# EAGLE design MTB-v1.2.0 (EAGLE 7.7.0)

## Sheet 1 of 4
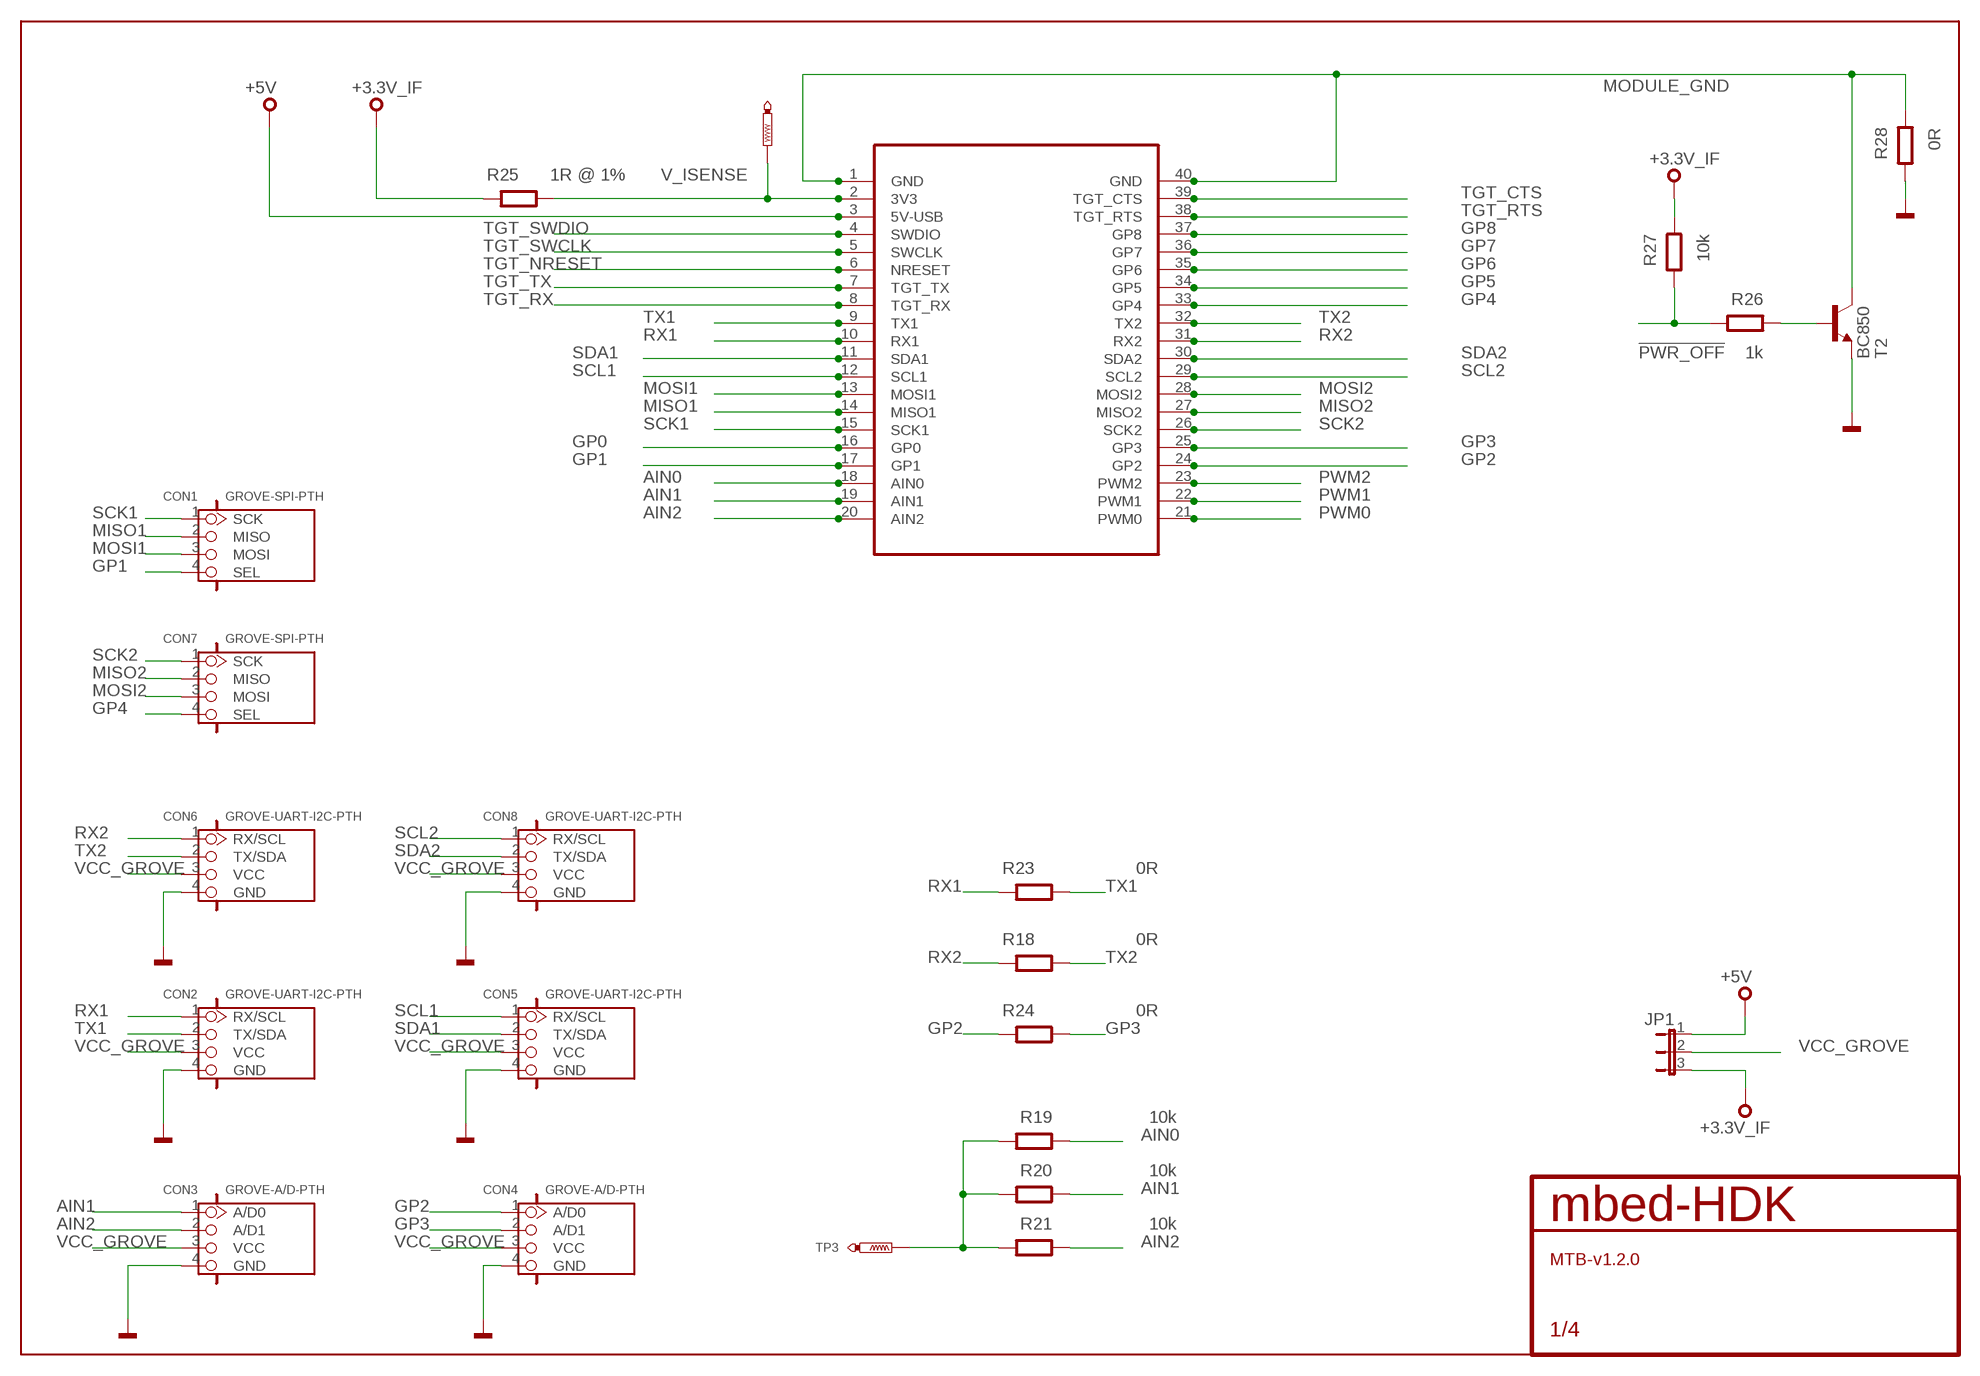
[diagram p0: schematic, sheet 1]

### Parts
CON1  GROVE-SPI-PTH  [HW4-2.0]
CON2  GROVE-UART-I2C-PTH  [HW4-2.0]
CON3  GROVE-A/D-PTH  [HW4-2.0]
CON4  GROVE-A/D-PTH  [HW4-2.0]
CON5  GROVE-UART-I2C-PTH  [HW4-2.0]
CON6  GROVE-UART-I2C-PTH  [HW4-2.0]
CON7  GROVE-SPI-PTH  [HW4-2.0]
CON8  GROVE-UART-I2C-PTH  [HW4-2.0]
JP1  JP2E  [JP2]
R18  0R  R0603  [0603@1]
R19  10k  R0603  [0603@1]
R20  10k  R0603  [0603@1]
R21  10k  R0603  [0603@1]
R23  0R  R0603  [0603@1]
R24  0R  R0603  [0603@1]
R25  1R @ 1%  R0603  [0603@1]
R26  1k  R0603  [0603@1]
R27  10k  R0603  [0603@1]
R28  0R  R0603  [0603@1]
SKT1  MODULE_SOCKET  [MODULE_SOCKET]
T2  BC850  [SOT23]
TP3  TEST-POINT-50R-PTH  [TP50-PTH]
TP8  PTR1TP07R  [TP07R]

### Nets
!PWR_OFF: R26.2 R27.2 ; also sheet 3
+3.3V_IF: JP1.3 R25.2 R27.1 ; also sheet 2,3,4
+5V: JP1.1 SKT1.3(5V-USB) SKT1.P$43 ; also sheet 2
AIN0: R19.1 SKT1.18(AIN0) SKT1.P$58 ; also sheet 4
AIN1: CON3.1(A/D0) R20.1 SKT1.19(AIN1) SKT1.P$59
AIN2: CON3.2(A/D1) R21.1 SKT1.20(AIN2) SKT1.P$60
GND: CON2.4(GND) CON3.4(GND) CON4.4(GND) CON5.4(GND) CON6.4(GND) CON8.4(GND) R28.2 T2.2(E) ; also sheet 2,3,4
GP0: SKT1.16(GP0) SKT1.P$56 ; also sheet 4
GP1: CON1.4(SEL) SKT1.17(GP1) SKT1.P$57
GP2: CON4.1(A/D0) R24.2 SKT1.24(GP2) SKT1.P$64 ; also sheet 4
GP3: CON4.2(A/D1) R24.1 SKT1.25(GP3) SKT1.P$65
GP4: CON7.4(SEL) SKT1.33(GP4) SKT1.P$73
GP5: SKT1.34(GP5) SKT1.P$74 ; also sheet 4
GP6: SKT1.35(GP6) SKT1.P$75 ; also sheet 4
GP7: SKT1.36(GP7) SKT1.P$76 ; also sheet 4
GP8: SKT1.37(GP8) SKT1.P$77
MISO1: CON1.2(MISO) SKT1.14(MISO1) SKT1.P$54 ; also sheet 4
MISO2: CON7.2(MISO) SKT1.27(MISO2) SKT1.P$67
MODULE_GND: R28.1 SKT1.1(GND) SKT1.40(GND) SKT1.P$41 SKT1.P$80 T2.3(C)
MOSI1: CON1.3(MOSI) SKT1.13(MOSI1) SKT1.P$53 ; also sheet 4
MOSI2: CON7.3(MOSI) SKT1.28(MOSI2) SKT1.P$68
N$24: R19.2 R20.2 R21.2 TP3.TP
N$28: R26.1 T2.1(B)
PWM0: SKT1.21(PWM0) SKT1.P$61 ; also sheet 4
PWM1: SKT1.22(PWM1) SKT1.P$62 ; also sheet 4
PWM2: SKT1.23(PWM2) SKT1.P$63 ; also sheet 4
RX1: CON2.1(RX/SCL) R23.2 SKT1.10(RX1) SKT1.P$50
RX2: CON6.1(RX/SCL) R18.2 SKT1.31(RX2) SKT1.P$71
SCK1: CON1.1(SCK) SKT1.15(SCK1) SKT1.P$55 ; also sheet 4
SCK2: CON7.1(SCK) SKT1.26(SCK2) SKT1.P$66
SCL1: CON5.1(RX/SCL) SKT1.12(SCL1) SKT1.P$52 ; also sheet 4
SCL2: CON8.1(RX/SCL) SKT1.29(SCL2) SKT1.P$69 ; also sheet 4
SDA1: CON5.2(TX/SDA) SKT1.11(SDA1) SKT1.P$51 ; also sheet 4
SDA2: CON8.2(TX/SDA) SKT1.30(SDA2) SKT1.P$70 ; also sheet 4
TGT_CTS: SKT1.39(TGT_CTS) SKT1.P$79 ; also sheet 3
TGT_NRESET: SKT1.6(NRESET) SKT1.P$46 ; also sheet 3
TGT_RTS: SKT1.38(TGT_RTS) SKT1.P$78 ; also sheet 3
TGT_RX: SKT1.8(TGT_RX) SKT1.P$48 ; also sheet 3
TGT_SWCLK: SKT1.5(SWCLK) SKT1.P$45 ; also sheet 3
TGT_SWDIO: SKT1.4(SWDIO) SKT1.P$44 ; also sheet 3
TGT_TX: SKT1.7(TGT_TX) SKT1.P$47 ; also sheet 3
TX1: CON2.2(TX/SDA) R23.1 SKT1.9(TX1) SKT1.P$49
TX2: CON6.2(TX/SDA) R18.1 SKT1.32(TX2) SKT1.P$72
V_ISENSE: R25.1 SKT1.2(3V3) SKT1.P$42 TP8.TP ; also sheet 3
VCC_GROVE: CON2.3(VCC) CON3.3(VCC) CON4.3(VCC) CON5.3(VCC) CON6.3(VCC) CON8.3(VCC) JP1.2

## Sheet 2 of 4
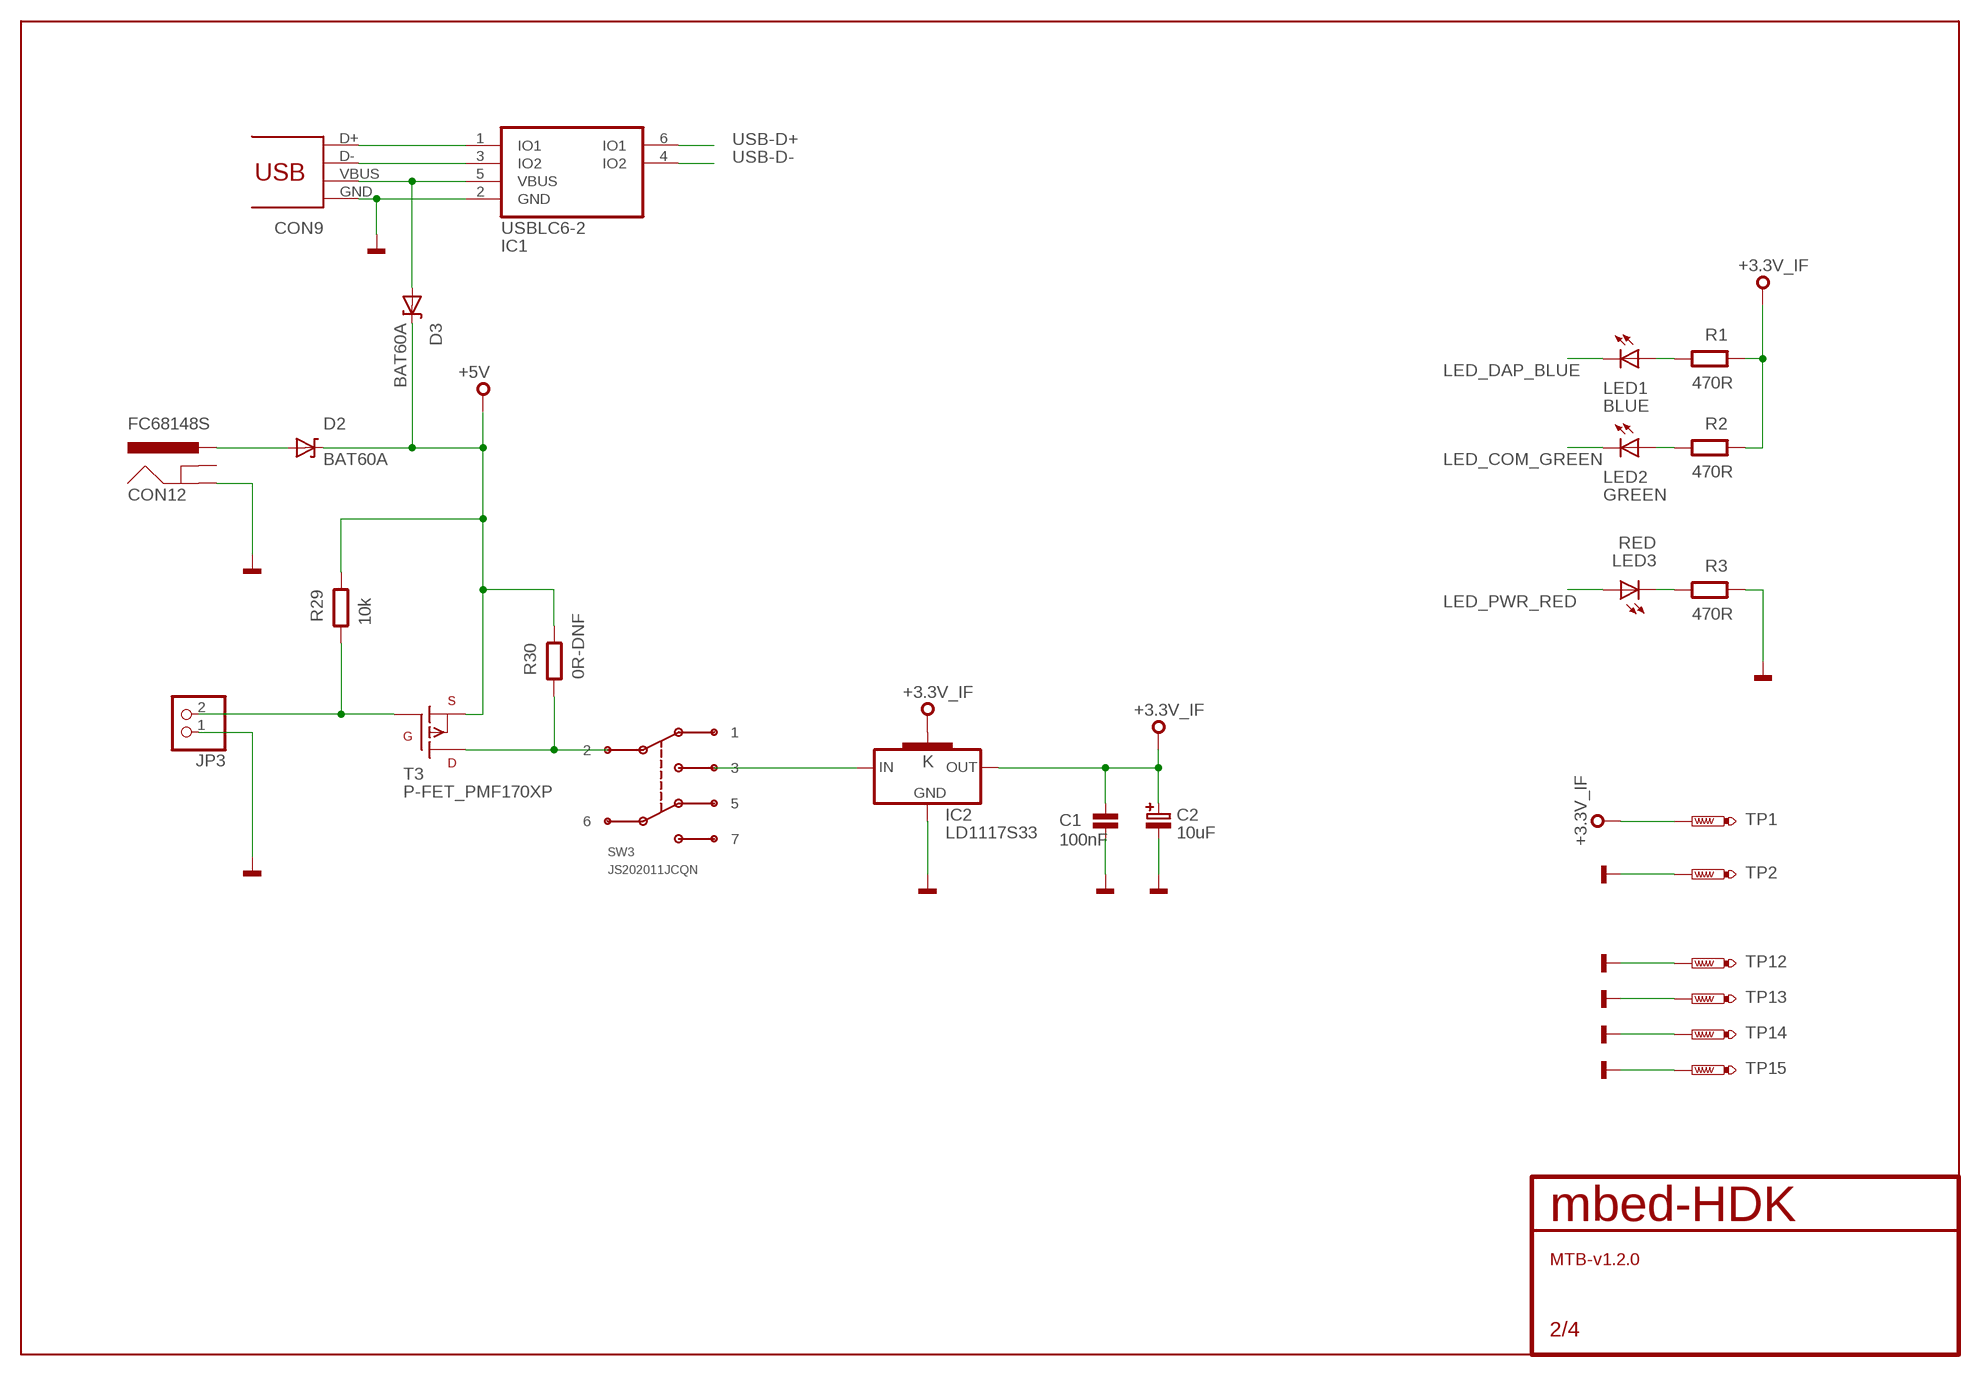
[diagram p1: schematic, sheet 2]

### Parts
C1  100nF  C0603  [0603]
C2  10uF  C-POLB  [SMC_B]
CON9  USB_MICROB  [MOLEX-47364-0001]
CON12  FC68148S  [FC68148S]
D2  BAT60A  [SOD323]
D3  BAT60A  [SOD323]
IC1  USBLC6-2SC6  [SOT23-6L]
IC2  LD1117S33  [SOT223]
JP3  PINHD-1X2  [1X02]
LED1  BLUE  LED0603  [CHIPLED_0603]
LED2  GREEN  LED0603  [CHIPLED_0603]
LED3  RED  LED0603  [CHIPLED_0603]
R1  470R  R0603  [0603@1]
R2  470R  R0603  [0603@1]
R3  470R  R0603  [0603@1]
R29  10k  R0603  [0603@1]
R30  0R-DNF  R0603  [0603@1]
SW3  JS202011JCQN  [JS202011JCQN]
T3  P-FET_PMF170XP  [SOT23-BEC]
TP1  TEST-POINT-50R-PTH  [TP50-PTH]
TP2  TEST-POINT-50R-PTH  [TP50-PTH]
TP12  TEST-POINT-50R-PTH  [TP50-PTH]
TP13  TEST-POINT-50R-PTH  [TP50-PTH]
TP14  TEST-POINT-50R-PTH  [TP50-PTH]
TP15  TEST-POINT-50R-PTH  [TP50-PTH]

### Nets
+3.3V_IF: C1.1 C2.+ IC2.2(OUT) IC2.4(K) R1.1 R2.1 TP1.TP ; also sheet 1,3,4
+5V: D2.K D3.K R29.1 R30.1 T3.E(S) ; also sheet 1
GND: C1.2 C2.- CON9.GND CON12.3(GND) IC1.2(GND) IC2.1(GND) JP3.1 R3.1 TP2.TP TP12.TP TP13.TP TP14.TP TP15.TP ; also sheet 1,3,4
LED_COM_GREEN: LED2.C ; also sheet 3
LED_DAP_BLUE: LED1.C ; also sheet 3
LED_PWR_RED: LED3.A ; also sheet 3
N$1: CON9.D+ IC1.1(IO1)
N$2: CON9.D- IC1.3(IO2)
N$6: LED2.A R2.2
N$9: LED3.C R3.2
N$13: LED1.A R1.2
N$27: CON9.VBUS D3.A IC1.5(VBUS)
N$29: R30.2 SW3.2 T3.C(D)
N$30: CON12.1-1(PWR) CON12.1-2(PWR) D2.A
N$31: IC2.3(IN) SW3.3
N$32: JP3.2 R29.2 T3.B(G)
USB-D+: IC1.6(IO1) ; also sheet 3
USB-D-: IC1.4(IO2) ; also sheet 3
Unconnected: CON12.2(GNDBREAK) SW3.1 SW3.5 SW3.6 SW3.7

## Sheet 3 of 4
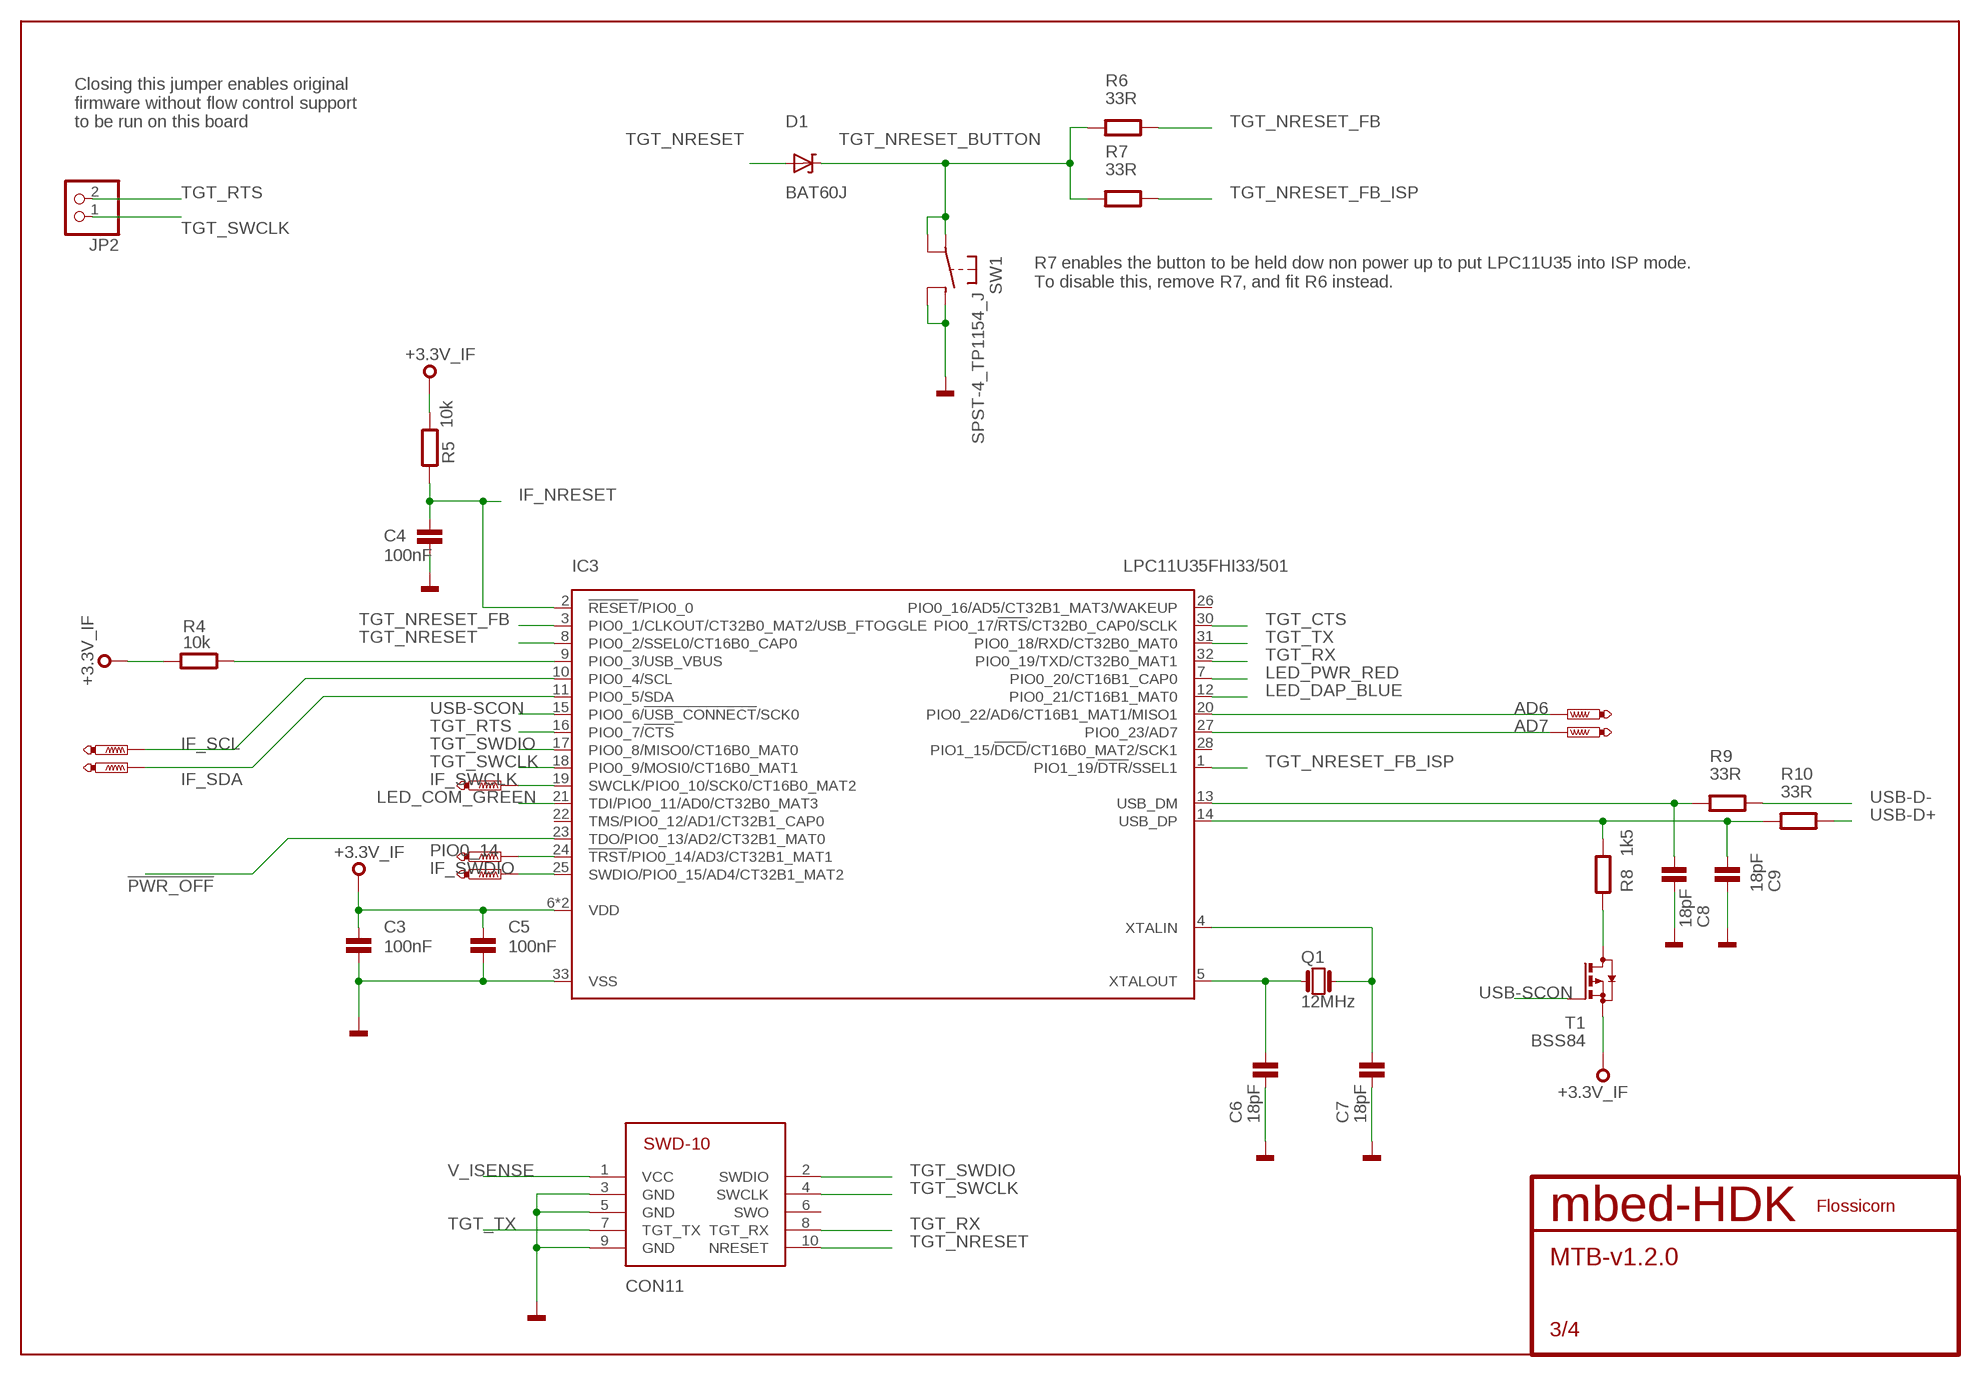
[diagram p2: schematic, sheet 3]

### Parts
C3  100nF  C0603  [0603]
C4  100nF  C0603  [0603]
C5  100nF  C0603  [0603]
C6  18pF  C0603  [0603]
C7  18pF  C0603  [0603]
C8  18pF  C0603  [0603]
C9  18pF  C0603  [0603]
CON11  SWD-10/TC2050_SMD  [FTSH-105-02]
D1  BAT60J  BAT60A  [BAT60A]
IC3  LPC11U35FHI33/501  [SOT617-3]
JP2  PINHD-1X2  [1X02]
Q1  12MHz  Q_3.2X2.5  [3.2X.2.5]
R4  10k  R0603  [0603@1]
R5  10k  R0603  [0603@1]
R6  33R  R0603  [0603@1]
R7  33R  R0603  [0603@1]
R8  1k5  R0603  [0603@1]
R9  33R  R0603  [0603@1]
R10  33R  R0603  [0603@1]
SS1  FLOSSICORN0.5  [FLOSSICORN-0.5]
SW1  SPST-4_TP1154_J  [TP-1154X]
T1  BSS84  [SOT23]
TP4  PTR1TP07R  [TP07R]
TP5  PTR1TP07R  [TP07R]
TP6  PTR1TP07R  [TP07R]
TP7  PTR1TP07R  [TP07R]
TP9  PTR1TP07R  [TP07R]
TP10  PTR1TP07R  [TP07R]
TP11  PTR1TP07R  [TP07R]

### Nets
!PWR_OFF: IC3.23(TDO/PIO0_13/AD2/CT32B1_MAT0) ; also sheet 1
+3.3V_IF: C3.1 C5.1 IC3.6(VDD) IC3.29(VDD) R4.2 R5.2 T1.2(S) ; also sheet 1,2,4
AD6: IC3.20(PIO0_22/AD6/CT16B1_MAT1/MISO1) TP7.TP
AD7: IC3.27(PIO0_23/AD7) TP6.TP
GND: C3.2 C4.2 C5.2 C6.2 C7.2 C8.2 C9.2 CON11.3(GND) CON11.5(GND) CON11.9(GND) IC3.33(VSS) SW1.B1 SW1.B2 ; also sheet 1,2,4
IF_NRESET: C4.1 IC3.2(!RESET!/PIO0_0) R5.1
IF_SCL: IC3.10(PIO0_4/SCL) TP4.TP
IF_SDA: IC3.11(PIO0_5/SDA) TP5.TP
IF_SWCLK: IC3.19(SWCLK/PIO0_10/SCK0/CT16B0_MAT2) TP10.TP
IF_SWDIO: IC3.25(SWDIO/PIO0_15/AD4/CT32B1_MAT2) TP9.TP
LED_COM_GREEN: IC3.21(TDI/PIO0_11/AD0/CT32B0_MAT3) ; also sheet 2
LED_DAP_BLUE: IC3.12(PIO0_21/CT16B1_MAT0) ; also sheet 2
LED_PWR_RED: IC3.7(PIO0_20/CT16B1_CAP0) ; also sheet 2
N$7: IC3.9(PIO0_3/USB_VBUS) R4.1
N$10: C6.1 IC3.5(XTALOUT) Q1.P$1
N$14: C7.1 IC3.4(XTALIN) Q1.P$3
N$23: R8.1 T1.3(D)
PIO0_14: IC3.24(!TRST!/PIO0_14/AD3/CT32B1_MAT1) TP11.TP
TGT_CTS: IC3.30(PIO0_17/!RTS!/CT32B0_CAP0/SCLK) ; also sheet 1
TGT_NRESET: CON11.10(NRESET) D1.A IC3.8(PIO0_2/SSEL0/CT16B0_CAP0) ; also sheet 1
TGT_NRESET_BUTTON: D1.K R6.2 R7.2 SW1.A1 SW1.A2
TGT_NRESET_FB: IC3.3(PIO0_1/CLKOUT/CT32B0_MAT2/USB_FTOGGLE) R6.1
TGT_NRESET_FB_ISP: IC3.1(PIO1_19/!DTR!/SSEL1) R7.1
TGT_RTS: IC3.16(PIO0_7/!CTS!) JP2.2 ; also sheet 1
TGT_RX: CON11.8(TGT_RX) IC3.32(PIO0_19/TXD/CT32B0_MAT1) ; also sheet 1
TGT_SWCLK: CON11.4(SWCLK) IC3.18(PIO0_9/MOSI0/CT16B0_MAT1) JP2.1 ; also sheet 1
TGT_SWDIO: CON11.2(SWDIO) IC3.17(PIO0_8/MISO0/CT16B0_MAT0) ; also sheet 1
TGT_TX: CON11.7(TGT_TX) IC3.31(PIO0_18/RXD/CT32B0_MAT0) ; also sheet 1
USB-D+: R10.1 ; also sheet 2
USB-D-: R9.1 ; also sheet 2
USB-SCON: IC3.15(PIO0_6/!USB_CONNECT!/SCK0) T1.1(G)
USB_DM: C8.1 IC3.13(USB_DM) R9.2
USB_DP: C9.1 IC3.14(USB_DP) R8.2 R10.2
V_ISENSE: CON11.1(VCC) ; also sheet 1
Unconnected: CON11.6(SWO) IC3.22(TMS/PIO0_12/AD1/CT32B1_CAP0) IC3.26(PIO0_16/AD5/CT32B1_MAT3/WAKEUP) IC3.28(PIO1_15/!DCD!/CT16B0_MAT2/SCK1)

### Notes on the sheet
- Closing this jumper enables original
  firmware without flow control support
  to be run on this board
- R7 enables the button to be held dow non power up to put LPC11U35 into ISP mode.
  To disable this, remove R7, and fit R6 instead.

## Sheet 4 of 4
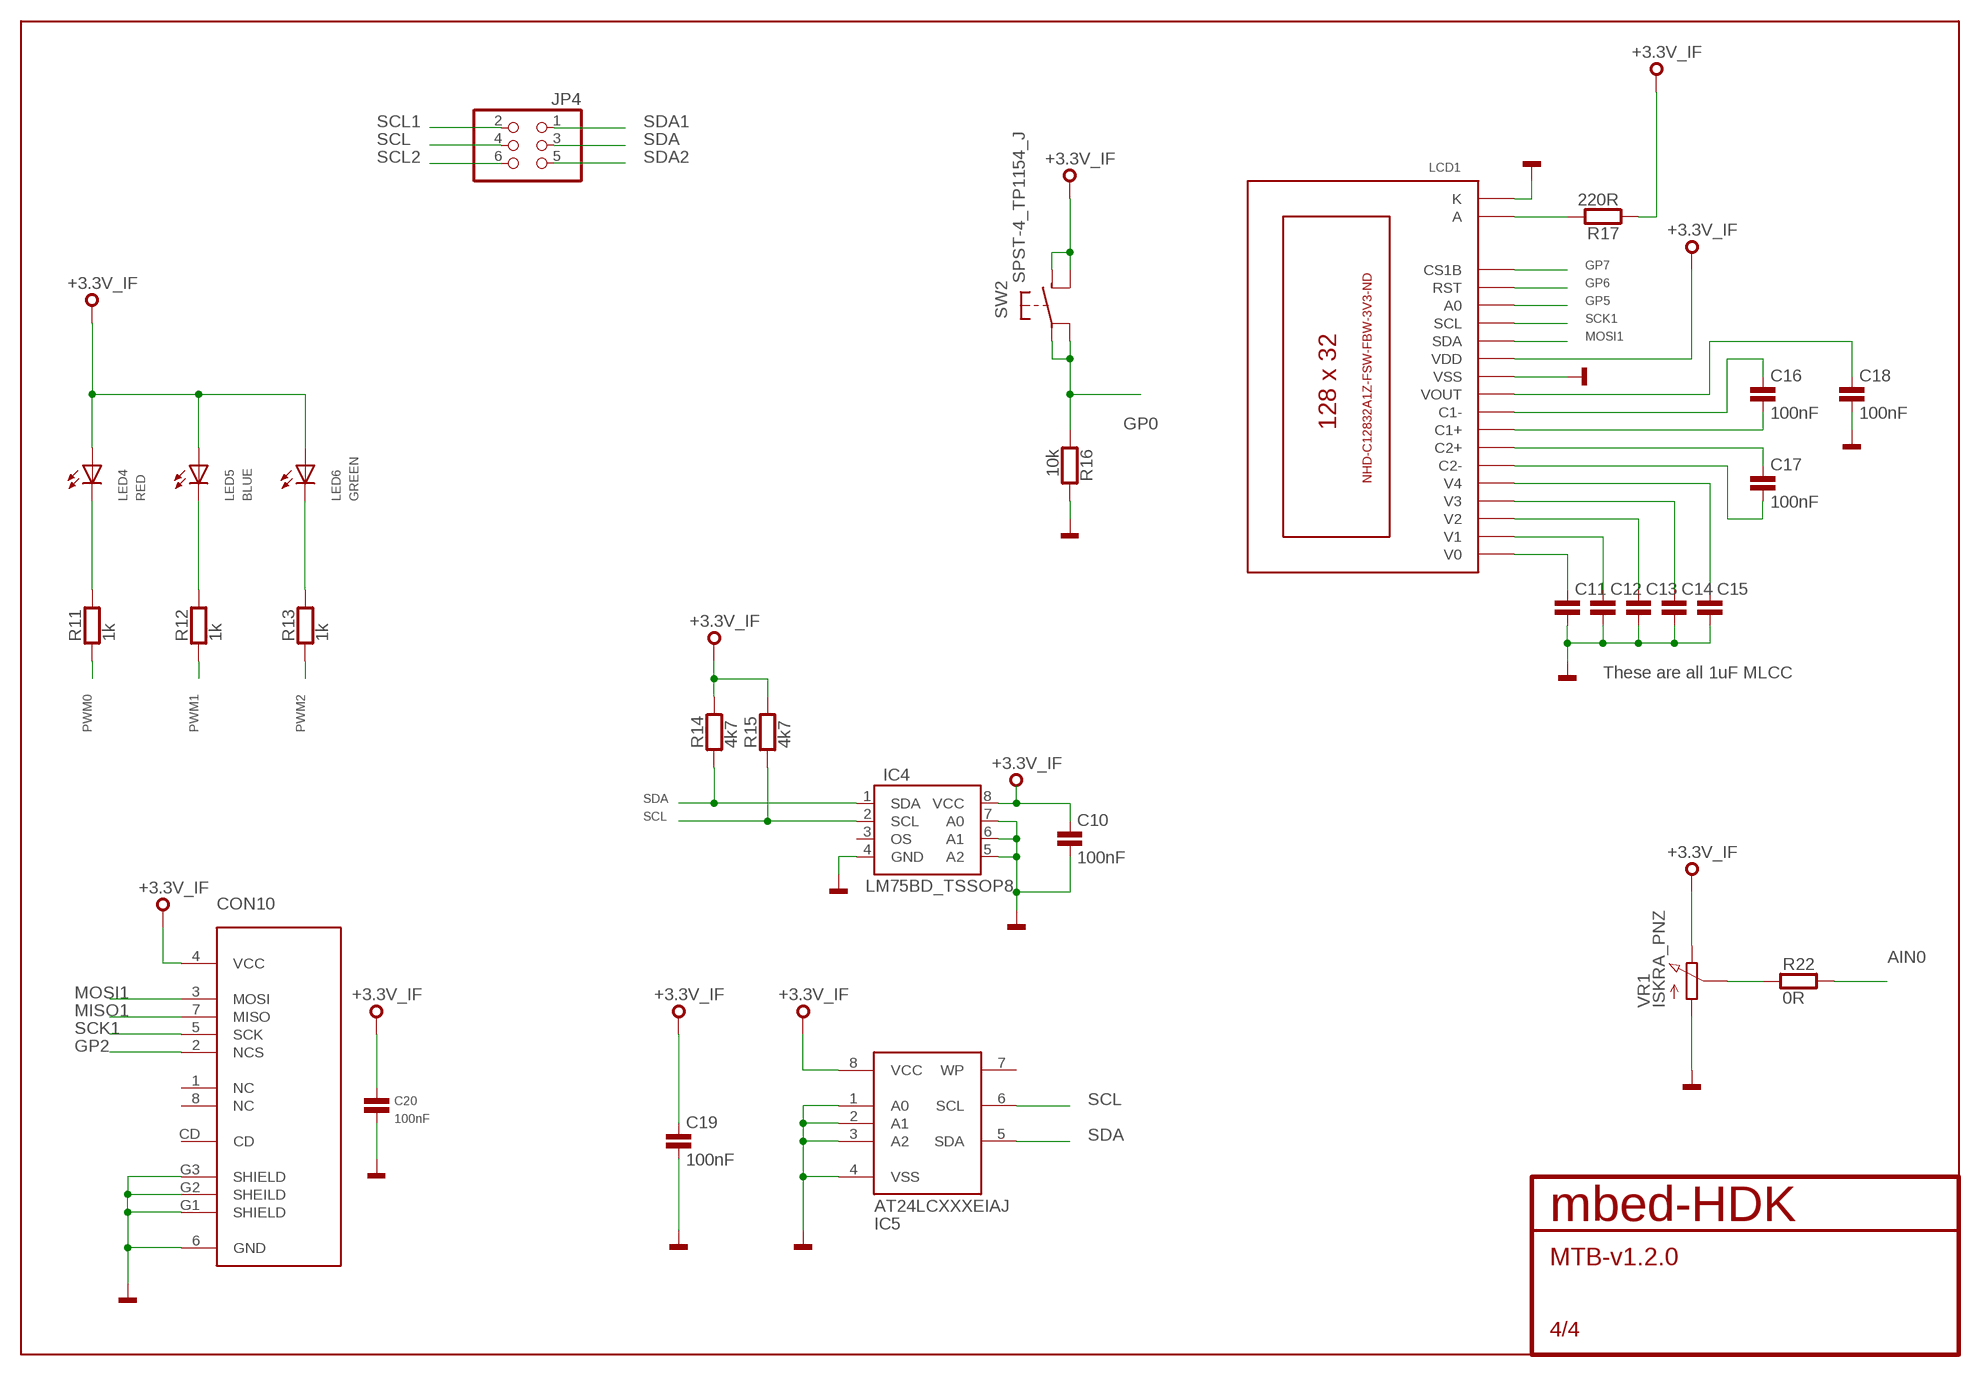
[diagram p3: schematic, sheet 4]

### Parts
C10  100nF  C0603  [0603]
C11  100nF  C0603  [0603]
C12  100nF  C0603  [0603]
C13  100nF  C0603  [0603]
C14  100nF  C0603  [0603]
C15  100nF  C0603  [0603]
C16  100nF  C0603  [0603]
C17  100nF  C0603  [0603]
C18  100nF  C0603  [0603]
C19  100nF  C0603  [0603]
C20  100nF  C0603  [0603]
CON10  MICRO-SD  [AMPHENOL-101-00660-68-6]
IC4  LM75BD_TSSOP8  [TSSOP8]
IC5  AT24LCXXXEIAJ  [SO08-EIAJ]
JP4  PINHD-2X3  [2X03]
LCD1  C12832A1Z  [C12832A1Z]
LED4  RED  LED0603  [CHIPLED_0603]
LED5  BLUE  LED0603  [CHIPLED_0603]
LED6  GREEN  LED0603  [CHIPLED_0603]
R11  1k  R0603  [0603]
R12  1k  R0603  [0603]
R13  1k  R0603  [0603]
R14  4k7  R0603  [0603]
R15  4k7  R0603  [0603]
R16  10k  R0603  [0603]
R17  220R  R0603  [0603]
R22  0R  R0603  [0603]
SW2  SPST-4_TP1154_J  [TP-1154X]
VR1  ISKRA_PNZ  [CA14V]

### Nets
+3.3V_IF: C10.1 C19.1 C20.1 CON10.4(VCC) IC4.8(VCC) IC5.8(VCC) LCD1.P$12(VDD) LED4.A LED5.A LED6.A R14.2 R15.2 R17.1 SW2.B1 SW2.B2 VR1.P$3(E) ; also sheet 1,2,3
AIN0: R22.2 ; also sheet 1
GND: C10.2 C11.2 C12.2 C13.2 C14.2 C15.2 C18.2 C19.2 C20.2 CON10.6(GND) CON10.G1(SHIELD) CON10.G2(SHEILD) CON10.G3(SHIELD) IC4.4(GND) IC4.5(A2) IC4.6(A1) IC4.7(A0) IC5.1(A0) IC5.2(A1) IC5.3(A2) IC5.4(VSS) LCD1.K LCD1.P$11(VSS) R16.2 VR1.P$1(A) ; also sheet 1,2,3
GP0: R16.1 SW2.A1 SW2.A2 ; also sheet 1
GP2: CON10.2(NCS) ; also sheet 1
GP5: LCD1.P$15(A0) ; also sheet 1
GP6: LCD1.P$16(RST) ; also sheet 1
GP7: LCD1.P$17(CS1B) ; also sheet 1
MISO1: CON10.7(MISO) ; also sheet 1
MOSI1: CON10.3(MOSI) LCD1.P$13(SDA) ; also sheet 1
N$3: C16.1 LCD1.P$9(C1-)
N$4: C17.1 LCD1.P$7(C2+)
N$5: C17.2 LCD1.P$6(C2-)
N$8: C16.2 LCD1.P$8(C1+)
N$11: C11.1 LCD1.P$1(V0)
N$12: C12.1 LCD1.P$2(V1)
N$15: C13.1 LCD1.P$3(V2)
N$16: C14.1 LCD1.P$4(V3)
N$17: C15.1 LCD1.P$5(V4)
N$18: C18.1 LCD1.P$10(VOUT)
N$19: LED4.C R11.2
N$20: LED6.C R13.2
N$21: LED5.C R12.2
N$22: LCD1.A R17.2
N$25: R22.1 VR1.P$2(S)
PWM0: R11.1 ; also sheet 1
PWM1: R12.1 ; also sheet 1
PWM2: R13.1 ; also sheet 1
SCK1: CON10.5(SCK) LCD1.P$14(SCL) ; also sheet 1
SCL: IC4.2(SCL) IC5.6(SCL) JP4.4 R15.1
SCL1: JP4.2 ; also sheet 1
SCL2: JP4.6 ; also sheet 1
SDA: IC4.1(SDA) IC5.5(SDA) JP4.3 R14.1
SDA1: JP4.1 ; also sheet 1
SDA2: JP4.5 ; also sheet 1
Unconnected: CON10.1(NC) CON10.8(NC) CON10.CD IC4.3(OS) IC5.7(WP)

### Notes on the sheet
- These are all 1uF MLCC

## Library data of the parts
C1 C3-C9 C20 = mbed-HDK:C: Capacitor
C2 = mbed-HDK:C-POL: Polarised capacitor
C10-C19 = mbed-rlcq:C
CON1 CON7 = Treadstone:GROVE-SPI-PTH
CON2 CON5 CON6 CON8 = Treadstone:GROVE-UART-I2C-PTH
CON3 CON4 = Treadstone:GROVE-A/D-PTH
CON9 = mbed-HDK:USB: USB Connectors
CON10 = mbed-HDK:MICRO-SD
CON11 = mbed-HDK-Connector:SWD-10/TC2050: 1mm pitch 10-Pin Cortex Programming Header with optional TC2050 footprint solderless interchangeable
CON12 = blackbriar:FC68148S: Power Jack This is the standard 5.5mm barrel jack for power. The PTH is the most common, proven, reliable, footprint. The Slot footprint only works if the mill layer is transmitted to the PCB fab house so be warned. Mating wall wart : TOL-00298 (and others)
D1 = mbed-HDK:BAT60A: Schottky Diode
D2 D3 = mbed-HDK-Transistor:BAT60A: SCHOTTKY DIODE; MF: Infineon; MFN: BAT60AE6327HTSA1; OC-DIGIKEY: BAT60AE6327HTSA1CT-ND; OC-MOUSER: 726-BAT60AE6327; OC-NEWARK: 85X4127
IC1 = mbed-HDK:USBLC6-2
IC2 = mbed-HDK:LD1117S33: VOLTAGE REGULATOR SMD 3,3V
IC3 = mbed-HDK:LPC11U35FHI33: 32-bit ARM Cortex-M0 microcontroller; up to 128 kB flash; up to 12 kB SRAM and 4 kB EEPROM; USB device; USART The LPC11U3x are a ARM Cortex-M0 based, low-cost 32-bit MCU family, designed for 8/16-bit microcontroller applications, offering performance, low power, simple instruction set and memory addressing together with reduced code size compared to existing 8/16-bit architectures. The LPC11U3x operate at CPU frequencies of up to 50 MHz. Equipped with a highly flexible and configurable Full Speed USB 2.0 device controller, the LPC11U3x brings unparalleled design flexibility and seamless integration to today’s demanding connectivity solutions. The peripheral complement of the LPC11U3x includes up to 128 kB of flash memory, up to 12 kB of SRAM data memory and 4 kB EEPROM, one Fast-mode Plus I 2 C-bus interface, one RS-485/EIA-485 USART with support for synchronous mode and smart card interface, two SSP interfaces, four general purpose counter/timers, a 10-bit ADC, and up to 54 general purpose I/O pins. AAL Eindhoven MK; FLASH: 64kB; GPIO: 26; SRAM: 12kB
IC4 = LabBoard:LM75BD
IC5 = mbed-HDK:AT24LCXXX: I2C EEPROM, 24LC family
JP1 = Treadstone:JP2E: JUMPER
JP2 JP3 = pinhead:PINHD-1X2: PIN HEADER
JP4 = pinhead:PINHD-2X3: PIN HEADER
LCD1 = LabBoard:C12832A1Z
LED1-LED6 = mbed-HDK:LED: SMD LED
Q1 = mbed-HDK:Q
R1-R10 R18-R21 R23-R30 = mbed-HDK:R
R11-R17 R22 = mbed-rlcq:R
SKT1 = Treadstone:MODULE_SOCKET
SS1 = blackbriar:FLOSSICORN
SW1 SW2 = mbed-HDK:SPST-4
SW3 = mbed-HDK-Switch:JS202011JCQN: SLIDE TOGGLE SWITCH VERTICAL (DPDT); MF: C&K Components; MFN: JS202011JCQN; OC-DIGIKEY: CKN10723CT-ND; OC-MOUSER: 611-JS202011JCQN
T1 = mbed-HDK:BSS84: P-CHANNEL MOS FET
T2 = mbed-HDK:BC850: NPN TRANSISTOR
T3 = Karasouli:P-FET
TP1-TP3 TP12-TP15 = mbed-HDK:TEST-POINT
TP4-TP11 = blackbriar:PTR1: TEST PIN
VR1 = LabBoard:ISKRA_PNZ

## Board
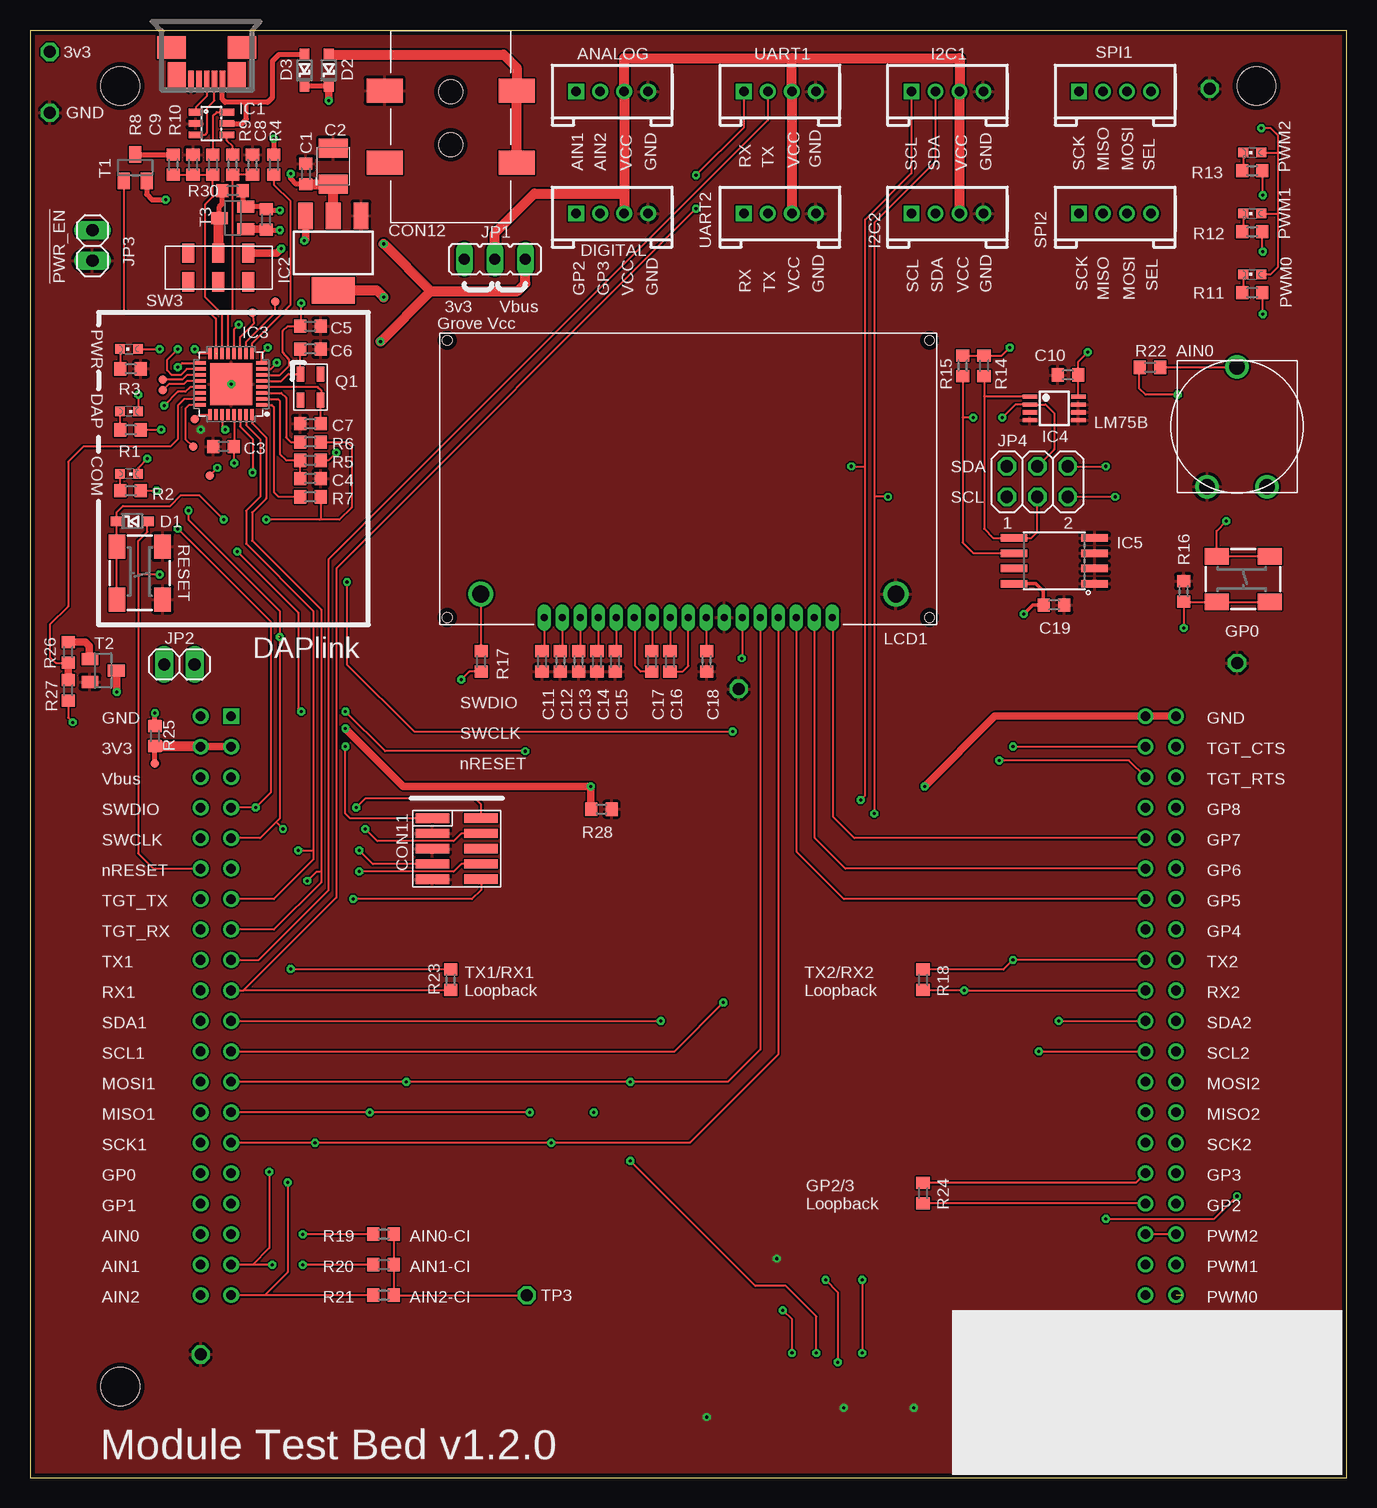
[diagram p4: board, top side]
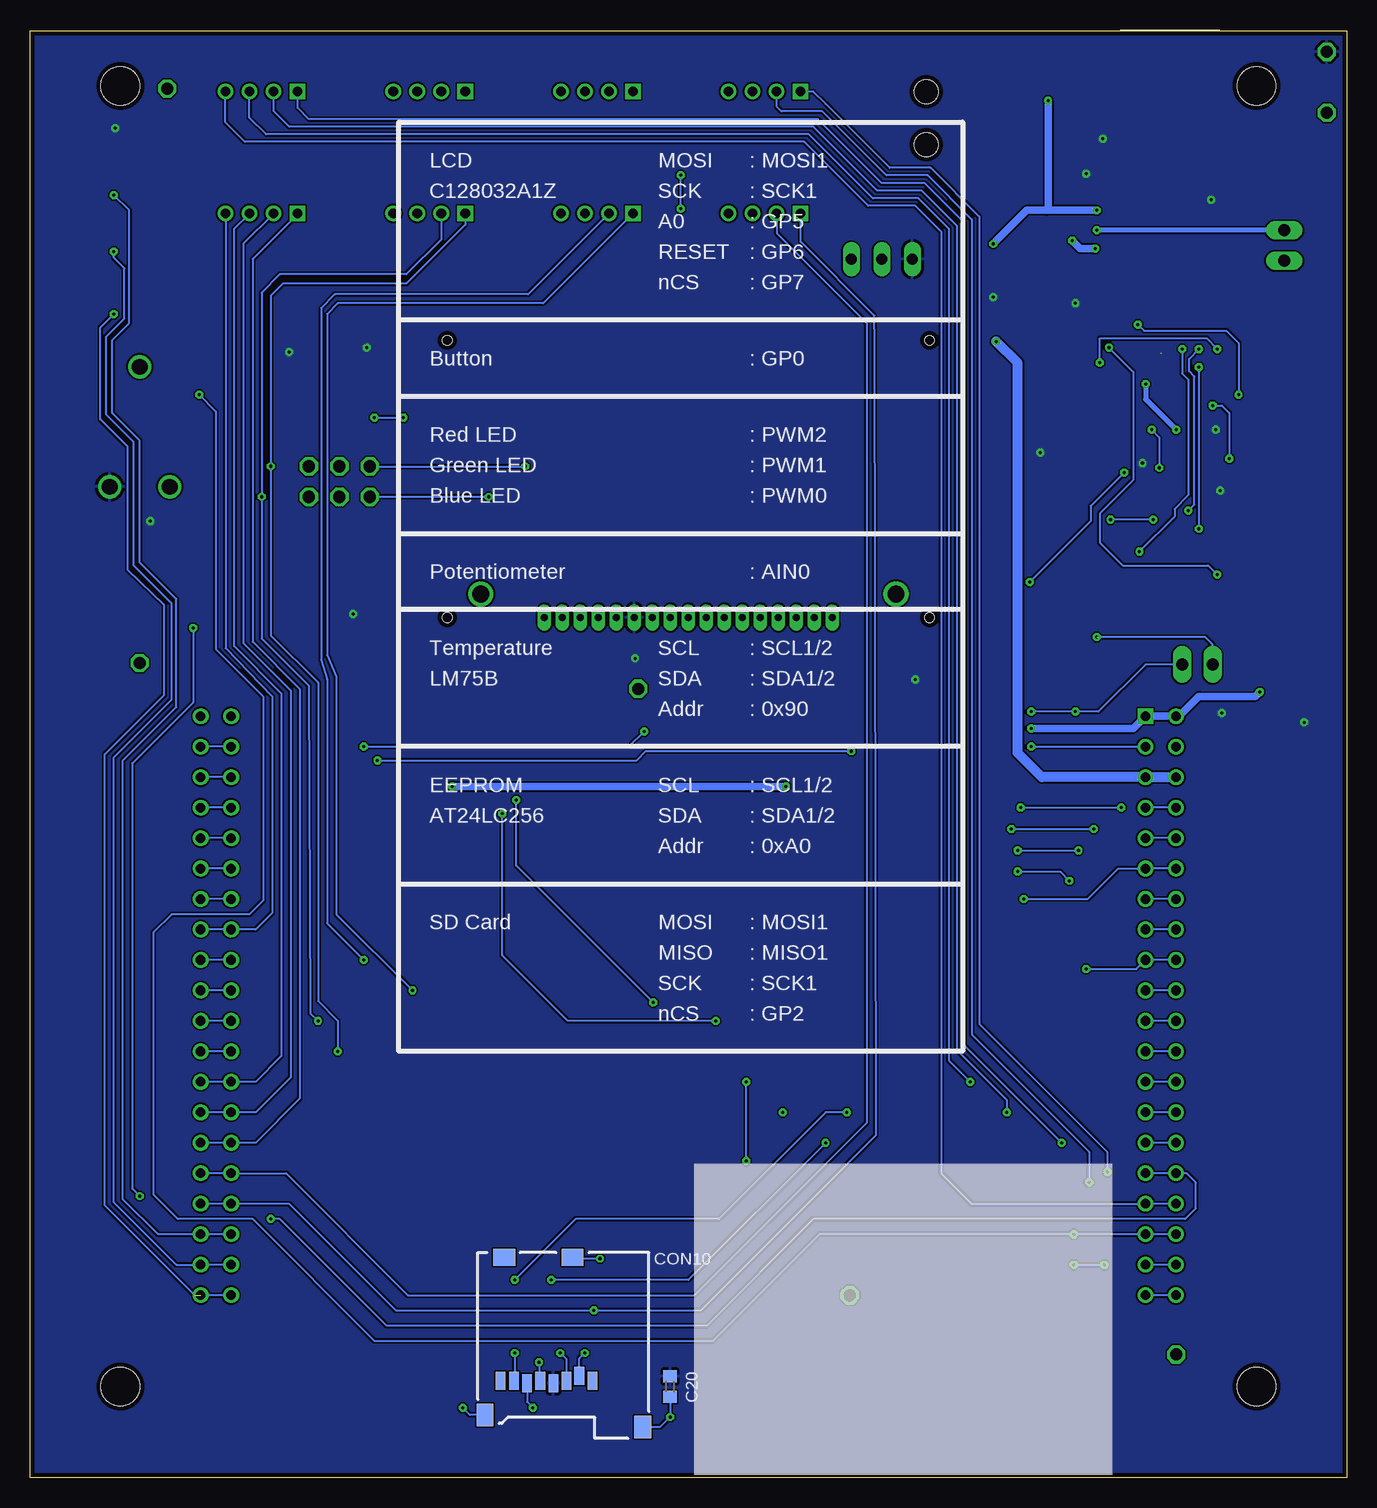
[diagram p5: board, bottom side, seen from below]

Size 109.73 x 120.7 mm. Coordinates in mm from the lower left corner, seen from the top.
Outline: 0,0 109.73,0 109.73,120.65 0,120.65 0,0
Copper layers ((1*16)): Top 0.035mm / dielectric 0.8mm / Bottom 0.035mm
Design rules "mbed-HDK-6-6-2-layer": minimum track width 6mil, minimum drill 9mil, track to track 6mil, track to pad 6mil, pad to pad 6mil, via to via 6mil, smd to smd 6mil, copper to edge 15mil, drill to drill 8mil, minimum pad ring 10mil, minimum via ring 8mil, stop-mask expansion 4mil, vias tented up to drill 0mil, thermal gap 10mil
Holes 3.2 mm at 7.52,7.62 7.52,116.03 102.2,7.62 102.2,116.03

### Footprints (pad centres in the part's own frame; a part is rotated, then mirrored left to right if it is on the bottom)
0603 = smd 1 x 1.1: 1 -0.85,0; 2 0.85,0
SMC_B = smd 1.6 x 2.4: + -1.5,0; - 1.5,0
HW4-2.0 = drill 0.8 pad 1.27 square: 1 -3,0 | drill 0.8 pad 1.27: 2 -1,0; 3 1,0; 4 3,0
MOLEX-47364-0001 = smd 1.7 x 0.45: 4 2.8,-0.65; D+ 2.8,0; D- 2.8,0.65; GND 2.8,-1.3; VBUS 2.8,1.3 | smd 1.9 x 2.375: GND1 0,2.95; GND4 0,-2.95 | smd 2.1 x 1.475: GND2 2.3,2.5; GND3 2.3,-2.5
AMPHENOL-101-00660-68-6 = smd 0.8 x 1.5: 1 -2.55,10.7; 2 -1.45,10.3; 3 -0.4,10.7; 4 0.7,10.9; 5 1.8,10.7; 6 2.9,10.9; 7 4,10.7; 8 5.1,10.7 | smd 1.8 x 1.4: CD 4.8,0.4; G1 -0.9,0.4 | smd 1.4 x 1.9: G2 6.4,13.55; G3 -6.75,14.55
FTSH-105-02 = smd 0.762 x 2.794: 1 0.381,-2.032; 2 0.381,2.032; 3 1.651,-2.032; 4 1.651,2.032; 5 2.921,-2.032; 6 2.921,2.032; 7 4.191,-2.032; 8 4.191,2.032; 9 5.461,-2.032; 10 5.461,2.032
FC68148S = smd 3 x 2: 1-1 5.5,-5; 1-2 5.5,-11; 2 -5.5,-11; 3 -5.5,-5 | hole 2: 0,-5.1; 0,-9.5
BAT60A = smd 1 x 0.8: A 1.3,0; K -1.3,0
SOD323 = smd 1 x 0.8: A 1.3,0; K -1.3,0
SOT23-6L = smd 0.55 x 1.2: 1 -0.95,-1.3; 2 0,-1.3; 3 0.95,-1.3; 4 0.95,1.3; 5 0,1.3; 6 -0.95,1.3
SOT223 = smd 1.219 x 2.235: 1 -2.311,-3.099; 2 0,-3.099; 3 2.311,-3.099 | smd 3.6 x 2.2: 4 0,3.099
SOT617-3 = smd 0.9 x 0.29: 1 -2.55,1.75; 2 -2.55,1.25; 3 -2.55,0.75; 4 -2.55,0.25; 5 -2.55,-0.25; 6 -2.55,-0.75; 7 -2.55,-1.25; 8 -2.55,-1.75; 17 2.55,-1.75; 18 2.55,-1.25; 19 2.55,-0.75; 20 2.55,-0.25; 21 2.55,0.25; 22 2.55,0.75; 23 2.55,1.25; 24 2.55,1.75 | smd 0.29 x 0.9: 9 -1.75,-2.55; 10 -1.25,-2.55; 11 -0.75,-2.55; 12 -0.25,-2.55; 13 0.25,-2.55; 14 0.75,-2.55; 15 1.25,-2.55; 16 1.75,-2.55; 25 1.75,2.55; 26 1.25,2.55; 27 0.75,2.55; 28 0.25,2.55; 29 -0.25,2.55; 30 -0.75,2.55; 31 -1.25,2.55; 32 -1.75,2.55 | smd 3.5 x 3.5: 33 0,0
TSSOP8 = smd 1.2 x 0.35: 1 -2.025,0.975; 2 -2.025,0.325; 3 -2.025,-0.325; 4 -2.025,-0.975; 5 2.025,-0.975; 6 2.025,-0.325; 7 2.025,0.325; 8 2.025,0.975
SO08-EIAJ = smd 0.61 x 2.21: 1 -1.905,-3.378; 2 -0.635,-3.378; 3 0.635,-3.378; 4 1.905,-3.378; 5 1.905,3.353; 6 0.635,3.353; 7 -0.635,3.353; 8 -1.905,3.353
JP2 = drill 0.914 long: 1 -2.54,0; 2 0,0; 3 2.54,0
1X02 = drill 1.016 long: 1 -1.27,0; 2 1.27,0
2X03 = drill 1.016 octagon: 1 -2.54,-1.27; 2 -2.54,1.27; 3 0,-1.27; 4 0,1.27; 5 2.54,-1.27; 6 2.54,1.27
C12832A1Z = drill 1.4: A 3.4,2.55; K 38,2.55 | drill 0.6 long: P$1 8.7,0.6; P$2 10.2,0.6; P$3 11.7,0.6; P$4 13.2,0.6; P$5 14.7,0.6; P$6 16.2,0.6; P$7 17.7,0.6; P$8 19.2,0.6; P$9 20.7,0.6; P$10 22.2,0.6; P$11 23.7,0.6; P$12 25.2,0.6; P$13 26.7,0.6; P$14 28.2,0.6; P$15 29.7,0.6; P$16 31.2,0.6; P$17 32.7,0.6 | hole 0.8: 0.6,0.6; 40.8,0.6; 40.8,23.7; 0.6,23.7
CHIPLED_0603 = smd 0.8 x 0.8: A 0,-0.75; C 0,0.75
3.2X.2.5 = smd 1.27 x 0.635: P$1 -1.092,-0.838; P$2 1.092,-0.838; P$3 1.092,0.838; P$4 -1.092,0.838
0603@1 = smd 1 x 1.1: 1 -0.85,0; 2 0.85,0
MODULE_SOCKET = drill 0.8 square: 1 0,0 | drill 0.8: 2 0,-2.54; 3 0,-5.08; 4 0,-7.62; 5 0,-10.16; 6 0,-12.7; 7 0,-15.24; 8 0,-17.78; 9 0,-20.32; 10 0,-22.86; 11 0,-25.4; 12 0,-27.94; 13 0,-30.48; 14 0,-33.02; 15 0,-35.56; 16 0,-38.1; 17 0,-40.64; 18 0,-43.18; 19 0,-45.72; 20 0,-48.26; 21 76.2,-48.26; 22 76.2,-45.72; 23 76.2,-43.18; 24 76.2,-40.64; 25 76.2,-38.1; 26 76.2,-35.56; 27 76.2,-33.02; 28 76.2,-30.48; 29 76.2,-27.94; 30 76.2,-25.4; 31 76.2,-22.86; 32 76.2,-20.32; 33 76.2,-17.78; 34 76.2,-15.24; 35 76.2,-12.7; 36 76.2,-10.16; 37 76.2,-7.62; 38 76.2,-5.08; 39 76.2,-2.54; 40 76.2,0; P$41 -2.54,0; P$42 -2.54,-2.54; P$43 -2.54,-5.08; P$44 -2.54,-7.62; P$45 -2.54,-10.16; P$46 -2.54,-12.7; P$47 -2.54,-15.24; P$48 -2.54,-17.78; P$49 -2.54,-20.32; P$50 -2.54,-22.86; P$51 -2.54,-25.4; P$52 -2.54,-27.94; P$53 -2.54,-30.48; P$54 -2.54,-33.02; P$55 -2.54,-35.56; P$56 -2.54,-38.1; P$57 -2.54,-40.64; P$58 -2.54,-43.18; P$59 -2.54,-45.72; P$60 -2.54,-48.26; P$61 78.74,-48.26; P$62 78.74,-45.72; P$63 78.74,-43.18; P$64 78.74,-40.64; P$65 78.74,-38.1; P$66 78.74,-35.56; P$67 78.74,-33.02; P$68 78.74,-30.48; P$69 78.74,-27.94; P$70 78.74,-25.4; P$71 78.74,-22.86; P$72 78.74,-20.32; P$73 78.74,-17.78; P$74 78.74,-15.24; P$75 78.74,-12.7; P$76 78.74,-10.16; P$77 78.74,-7.62; P$78 78.74,-5.08; P$79 78.74,-2.54; P$80 78.74,0
TP-1154X = smd 2 x 1.4: A1 -2.2,1.9; A2 2.2,1.9; B1 -2.2,-1.9; B2 2.2,-1.9
JS202011JCQN = smd 1 x 1.6: 1 0,2.4; 2 2.5,2.4; 3 5,2.4; 5 0,0; 6 2.5,0; 7 5,0
SOT23 = smd 1 x 1.4: 1 -0.95,-1.1; 2 0.95,-1.1; 3 0,1.1
SOT23-BEC = smd 1 x 1.4: B -0.95,-1.1; C 0,1.1; E 0.95,-1.1
TP50-PTH = drill 1 octagon: TP 0,0
TP07R = smd 0.7 x 0.7: TP 0,0
CA14V = drill 1.3: P$1 -2.5,-5; P$2 0,5; P$3 2.5,-5

### Placement (x,y rotation side)
C1  22.99,108.71 90 top
C2  25.27,109.35 90 top
C3  16.13,85.98 180 top
C4  23.37,83.31 0 top
C5  23.37,96.01 0 top
C6  23.37,94.11 0 top
C7  23.37,87.88 180 top
C8  18.54,109.47 90 top
C9  13.59,109.47 90 top
C10  86.49,91.95 180 top
C11  42.67,68.07 270 top
C12  44.2,68.07 270 top
C13  45.72,68.07 270 top
C14  47.24,68.07 270 top
C15  48.77,68.07 270 top
C16  53.34,68.07 90 top
C17  51.82,68.07 270 top
C18  56.39,68.07 270 top
C19  85.34,72.77 0 top
C20  56.39,7.62 270 bottom
CON1  90.42,115.57 0 top
CON2  62.48,115.57 0 top
CON3  48.51,115.57 0 top
CON4  48.51,105.41 0 top
CON5  76.45,115.57 0 top
CON6  62.48,105.41 0 top
CON7  90.42,105.41 0 top
CON8  76.45,105.41 0 top
CON9  14.73,119.25 270 top
CON10  65.41,18.8 180 bottom
CON11  35.56,55.37 270 top
CON12  35.05,120.65 0 top
D1  8.51,79.76 0 top
D2  24.89,117.35 90 top
D3  22.86,117.35 90 top
IC1  15.11,112.9 270 top
IC2  25.27,102.11 180 top
IC3  16.76,91.19 180 top
IC4  85.34,89.15 0 top
IC5  85.34,76.45 90 top
JP1  38.73,101.6 180 top
JP2  12.45,67.82 0 top
JP3  5.21,102.74 90 top
JP4  83.95,83.06 0 top
LCD1  34.16,71.12 0 top
LED1  8.25,88.9 270 top
LED2  8.25,83.69 270 top
LED3  8.25,94.11 90 top
LED4  101.85,100.33 90 top
LED5  101.85,105.41 90 top
LED6  101.85,110.49 90 top
Q1  23.37,90.93 270 top
R1  8.38,87.38 180 top
R2  8.38,82.3 180 top
R3  8.38,92.46 180 top
R4  20.32,109.47 90 top
R5  23.37,84.84 0 top
R6  23.37,86.36 0 top
R7  23.37,81.79 0 top
R8  11.94,109.47 270 top
R9  16.89,109.47 270 top
R10  15.24,109.47 270 top
R11  101.85,98.81 180 top
R12  101.85,103.89 180 top
R13  101.85,108.97 180 top
R14  79.5,92.71 90 top
R15  77.72,92.71 90 top
R16  96.14,73.91 90 top
R17  37.59,68.07 90 top
R18  74.42,41.53 270 top
R19  29.46,20.32 0 top
R20  29.46,17.78 0 top
R21  29.46,15.24 0 top
R22  93.34,92.58 180 top
R23  35.05,41.53 270 top
R24  74.42,23.75 270 top
R25  10.41,61.85 90 top
R26  3.17,68.83 270 top
R27  3.17,65.66 90 top
R28  47.62,55.75 0 top
R29  19.68,104.9 270 top
R30  16.89,107.31 180 top
SKT1  16.76,63.5 0 top
SS1  63.12,61.98 0 top
SW1  9.14,75.44 90 top
SW2  101.09,74.93 180 top
SW3  13.21,99.7 0 top
T1  8.76,109.22 0 top
T2  6.1,67.31 270 top
T3  16.89,105.03 90 top
TP1  1.65,118.87 0 top
TP2  1.65,113.79 0 top
TP3  41.4,15.24 0 top
TP4  20.45,98.04 0 top
TP5  18.54,97.16 0 top
TP6  14.99,83.57 0 top
TP7  11.05,90.68 0 top
TP8  10.41,59.56 90 top
TP9  13.72,88.27 0 top
TP10  11.05,91.57 0 top
TP11  13.59,85.98 0 top
TP12  14.22,10.29 0 top
TP13  100.58,67.94 0 top
TP14  98.3,115.82 0 top
TP15  59.05,65.79 0 top
VR1  100.58,87.63 0 top

### Tracks (layer width: path | path; a pad name or v marks a point on that pad's centre or on a via)
!PWR_OFF
  Top 0.152: IC3.23 12.85,89.94 12.32,89.41 12.32,86.61 11.68,85.98 4.45,85.98 3.17,84.71 3.17,72.64 1.65,71.12 1.65,68.45 2.16,67.94 3.14,67.94 R26.2
  Top 0.61: R27.2 R26.2
+3.3V_IF  (via drill 0.25 pad 0.25)
  Top 0.152: R1.1 v10.92,87.38 | IC3.29 17.01,86.01 C3.1 16.98,84.62 v17.02,84.58 | v22.61,97.92 22.61,96.1 C5.1 21.46,96.01 21.08,95.63 21.08,93.85 21.59,93.22 21.59,92.71 20.82,91.94 IC3.6 | v99.69,79.76 98.89,78.95 SW2.B2 SW2.B1 | R5.2 24.89,84.84 v25.53,85.47 | R17.1 36.61,67.22 v35.94,66.55 | LCD1.P$12 59.36,68.38 v59.31,68.33 | v88.14,93.85 87.34,93.05 C10.1 87.37,91.92 IC4.8 | R15.2 R14.2 80.99,93.56 v81.66,94.23 | LED4.A 103.38,100.33 104.01,100.97 104.01,105.41 | 104.01,105.41 104.01,110.49 | 104.01,110.49 104.01,111.89 103.38,112.52 v102.62,112.52 v102.6,112.51 | LED6.A 104.01,110.49 | LED5.A 104.01,105.41 | R2.1 v10.54,82.3 | R27.1 3.17,63.37 v3.56,62.99
  Top 0.305: IC5.8 83.82,74.55 84.45,73.91 84.45,72.81 C19.1 83.57,72.77 v82.8,72.01
  Top 0.406: R25.2 v10.41,63.75 | v20.32,111.63 R4.2 | C1.1 22.19,107.86 21.72,108.33 v21.72,108.71 | T1.2 9.71,107 10.16,106.55 v11.3,106.55
  Top 0.813: IC2.4 28.88,99.01 v29.46,98.42 | IC2.2 C2.+ 25.26,107.86 C1.1
  pour Bottom: 0,0 109.73,0 109.73,120.65 0,120.65
+5V  (via drill 0.25 pad 0.25)
  Top 0.152: R29.1 19.77,105.66
  Top 0.406: D3.K D2.K | R29.1 19.46,105.98 T3.E 17.74,106.23 R30.1 | 19.77,105.66 v20.83,105.66
  Top 0.61: D2.K v24.89,114.81
  Top 0.813: v29.46,102.87 33.4,98.93 | 33.4,98.93 40.64,98.93 41.27,99.57 JP1.1 | v29.21,94.74 33.4,98.93
  Bottom 0.61: v20.83,105.66 25.02,105.66 | 25.02,105.66 26.67,105.66 v29.46,102.87 | v24.89,114.81 24.89,105.79 25.02,105.66
  Bottom 0.813: v29.21,94.74 27.43,92.96 27.43,60.45 25.4,58.42 SKT1.3 SKT1.P$43
AD6
  Top 0.152: IC3.20 13.08,91.44 12.83,91.19 11.55,91.18 TP7.TP
AD7  (via drill 0.25 pad 0.25)
  Top 0.152: 15.63,84.21 v15.62,84.2 TP6.TP | IC3.27 16.01,87.62 v16.26,87.38
  Bottom 0.152: v16.26,87.38 15.62,86.74 v15.62,84.2
AIN0  (via drill 0.25 pad 0.25)
  Top 0.152: v95.63,90.3 92.96,90.3 92.46,90.81 92.46,92.54 R22.2 | R19.1 v22.73,20.32
  Bottom 0.152: v95.63,90.3 94.23,88.9 94.23,69.09 90.3,65.15 90.3,48.13 91.44,46.99 97.92,46.99 99.44,45.47 99.44,23.62 97.41,21.59 91.19,21.59 81.03,11.43 52.83,11.43 43.94,20.32 v22.73,20.32 SKT1.18 SKT1.P$58
AIN1  (via drill 0.25 pad 0.25)
  Top 0.152: v19.94,25.53 19.94,19.18 18.54,17.78 | 18.54,17.78 SKT1.19 | R20.1 v22.73,17.78 | v20.19,17.78 18.54,17.78
  Bottom 0.152: v19.94,25.53 19.94,27.18 30.61,37.85 30.61,105.16 34.67,109.22 38.1,109.22 43.43,114.55 44.45,115.57 CON3.1 | v22.73,17.78 v20.19,17.78 | SKT1.P$59 SKT1.19
AIN2  (via drill 0.25 pad 0.25)
  Top 0.152: v21.46,24.64 21.46,17.14 19.56,15.24 | 19.56,15.24 SKT1.20 | R21.1 19.56,15.24
  Bottom 0.152: v21.46,24.64 21.46,27.18 31.24,36.96 31.24,104.9 34.92,108.59 38.35,108.59 43.69,113.92 47.12,113.92 47.5,114.3 47.5,115.55 CON3.2 | SKT1.P$60 SKT1.20
GND  (via drill 0.25 pad 0.25)
  Bottom 0.152: v67.82,5.84 68.3,6.33 CON10.6 | CON10.G2 73.06,5.25 v73.66,5.84 | CON10.G3 57.22,4.25 v56.39,5.08 C20.2 | CON10.G1 64.25,18.3 v62.23,18.29
  Bottom 0.406: IC3.33 16.76,89.92 v14.22,87.38
  other vias: 16.76,91.19
  pour Top: 0,0 0,120.65 109.73,120.65 109.73,0
GP0  (via drill 0.25 pad 0.25)
  Top 0.152: R16.1 96.14,73.03 | 96.14,73.03 SW2.A2 SW2.A1 | 96.14,73.03 v96.14,70.87 | v89.66,21.59 98.68,21.59 v100.58,23.5
  Bottom 0.152: v96.14,70.87 96.14,64.64 101.22,59.56 101.22,24.13 v100.58,23.5 | v89.66,21.59 88.9,21.59 80.14,12.83 80.01,12.7 53.34,12.7 44.45,21.59 13.46,21.59 12.57,22.48 12.57,24.64 13.33,25.4 SKT1.P$56 SKT1.16
GP1
  Bottom 0.152: SKT1.P$57 SKT1.17 31.24,22.86 33.78,25.4 33.78,103.89 35.94,106.05 39.88,106.05 45.21,111.38 91.82,111.38 93.47,113.03 93.47,115.52 CON1.4
GP2  (via drill 0.25 pad 0.25)
  Top 0.152: SKT1.24 92.92,22.9 R24.2 | v63.5,10.41 63.5,13.21 v62.74,13.97
  Bottom 0.152: SKT1.P$64 SKT1.24 88.14,22.86 79.25,13.97 v62.74,13.97 53.85,13.97 39.24,28.58 39.37,95.76 39.37,96.9 45.51,103.05 CON4.1 | CON10.2 63.95,9.96 v63.5,10.41
GP3
  Top 0.152: SKT1.25 92.16,24.6 R24.1
  Bottom 0.152: SKT1.P$65 SKT1.25 88.39,25.4 78.23,15.24 54.36,15.24 40,29.59 40,96.27 47.5,103.76 47.5,105.39 CON4.2
GP4
  Bottom 0.152: CON7.4 93.42,69.17 89.53,65.15 89.53,47.12 90.93,45.72 SKT1.33 SKT1.P$73
GP5
  Top 0.152: SKT1.34 67.82,48.26 63.88,52.2 63.88,71.7 LCD1.P$15
  Bottom 0.152: SKT1.34 SKT1.P$74
GP6
  Top 0.152: SKT1.35 67.94,50.8 65.41,53.34 65.41,71.68 LCD1.P$16
  Bottom 0.152: SKT1.35 SKT1.P$75
GP7
  Top 0.152: SKT1.36 68.71,53.34 66.93,55.12 66.93,71.65 LCD1.P$17
  Bottom 0.152: SKT1.36 SKT1.P$76
GP8
  Bottom 0.152: SKT1.37 SKT1.P$77
IF_NRESET
  Top 0.152: C4.1 R5.1 21.34,84.84 20.83,85.34 20.83,89.79 20.68,89.94 IC3.2
IF_SCL
  Top 0.152: IC3.10 18.01,94.72 20.45,97.16 TP4.TP
IF_SDA
  Top 0.152: IC3.11 17.51,95.11 18.67,96.27 TP5.TP
IF_SWCLK
  Top 0.152: IC3.19 13.07,91.94 12.7,91.57 TP10.TP
IF_SWDIO
  Top 0.152: TP9.TP 14.09,88.64 IC3.25
LED_COM_GREEN  (via drill 0.25 pad 0.25)
  Top 0.152: IC3.21 13.33,90.93 12.95,90.55 12.32,90.55 v11.18,89.41 | v9.78,84.96 9.02,84.2 9.02,83.7 LED2.C
  Bottom 0.152: v11.18,89.41 10.41,89.41 9.78,88.77 v9.78,84.96
LED_DAP_BLUE  (via drill 0.25 pad 0.25)
  Top 0.152: IC3.12 17.01,95.75 v17.4,96.14 | v9.02,90.3 9,90.28 LED1.C
  Bottom 0.152: v17.4,96.14 16.89,95.63 10.03,95.63 9.02,94.61 v9.02,90.3
LED_PWR_RED  (via drill 0.25 pad 0.25)
  Top 0.152: IC3.7 20.05,92.44 v20.57,92.96 | LED3.A v10.79,94.11
  Bottom 0.152: v20.57,92.96 20.57,95 11.68,95 v10.79,94.11
MISO1  (via drill 0.25 pad 0.25)
  Top 0.152: SKT1.14 v28.32,30.48 v41.66,30.48 | v69.34,16.51 v69.34,10.41
  Bottom 0.152: SKT1.P$54 SKT1.14 | v41.66,30.48 43.43,30.48 52.32,21.59 64.26,21.59 v69.34,16.51 | v69.34,10.41 69.34,8.16 CON10.7 | v28.32,30.48 28.32,31.5 32.51,35.69 32.51,104.39 35.43,107.31 39.12,107.31 44.45,112.65 88.14,112.65 89.41,113.92 89.41,115.55 CON1.2
MISO2
  Bottom 0.152: CON7.2 89.42,105.39 91.95,102.87 91.95,69.6 88.01,65.66 88.01,33.4 90.93,30.48 SKT1.27 SKT1.P$67
MODULE_GND  (via drill 0.25 pad 0.25)
  Top 0.61: SKT1.P$80 SKT1.40 80.39,63.5 v74.55,57.66 | v26.29,62.48 31.11,57.66 v46.74,57.66 46.74,55.79 R28.1 | v7.24,65.53 7.24,67.27 T2.3
  Bottom 0.61: v74.55,57.66 v46.74,57.66 | v26.29,62.48 17.78,62.48 SKT1.1 SKT1.P$41 13.97,63.5 12.32,65.15 7.62,65.15 v7.24,65.53
MOSI1  (via drill 0.25 pad 0.25)
  Top 0.152: SKT1.13 v31.37,33.02 v50.04,33.02 58.17,33.02 60.86,35.72 LCD1.P$13 | v65.53,10.41 65.53,13.46 62.99,16 60.45,16 v50.04,26.42
  Bottom 0.152: v31.37,33.02 33.15,34.8 33.15,104.14 35.69,106.68 39.5,106.68 44.83,112.01 90.04,112.01 91.44,113.41 91.44,115.55 CON1.3 | SKT1.P$53 SKT1.13 | CON10.3 65,9.89 v65.53,10.41 | v50.04,26.42 v50.04,33.02
MOSI2
  Bottom 0.152: CON7.3 92.71,104.12 92.71,69.34 88.77,65.41 88.77,35.18 90.93,33.02 SKT1.28 SKT1.P$68
N$1
  Top 0.152: CON9.D+ 14.73,115.19 13.81,114.27 IC1.1
N$2
  Top 0.152: IC1.3 14.54,111.95 14.73,112.14 14.73,114.17 15.37,114.81 15.37,116.44 CON9.D-
N$3
  Top 0.152: C16.1 54.39,67.22 54.86,67.69 LCD1.P$9
N$4
  Top 0.152: LCD1.P$7 51.86,68.97 C17.1
N$5
  Top 0.152: C17.2 50.89,67.22 50.42,67.69 50.42,71.66 LCD1.P$6
N$6
  Top 0.152: R2.2 7.53,83.67 LED2.A
N$7
  Top 0.152: IC3.9 18.51,94.59 21.72,97.79 21.72,106.43 20.32,107.82 R4.1
N$8
  Top 0.152: LCD1.P$8 53.36,68.94 C16.2
N$9
  Top 0.152: 7.53,94.08 R3.2
  Top 0.406: LED3.C 7.53,94.08
N$10
  Top 0.152: IC3.5 20.95,91.44 21.54,92.02 Q1.P$1 22.53,94.09 C6.1
N$11
  Top 0.152: LCD1.P$1 42.86,69.11 C11.1
N$12
  Top 0.152: LCD1.P$2 44.36,69.09 C12.1
N$13
  Top 0.152: R1.2 7.53,88.87 LED1.A
N$14
  Top 0.152: C7.1 24.22,89.83 Q1.P$3 24.26,89.89 24.26,90.68 24,90.94 IC3.4
N$15
  Top 0.152: LCD1.P$3 45.86,69.06 C13.1
N$16
  Top 0.152: LCD1.P$4 47.36,69.04 C14.1
N$17
  Top 0.152: LCD1.P$5 48.86,69.02 C15.1
N$18
  Top 0.152: C18.1 56.39,71.69 LCD1.P$10
N$19
  Top 0.152: LED4.C 101.1,98.81 R11.2
N$20
  Top 0.152: LED6.C 101.1,108.97 R13.2
N$21
  Top 0.152: LED5.C 101.1,103.89 R12.2
N$22
  Top 0.152: R17.2 37.59,73.64 LCD1.A
N$23
  Top 0.406: T1.3 R8.1
N$24
  Top 0.152: R19.2 R20.2 R21.2 TP3.TP
N$25
  Top 0.152: R22.1 100.54,92.58 VR1.P$2
N$26  (via drill 0.25 pad 0.25)
  other vias: 46.99,30.48
N$27
  Top 0.406: CON9.VBUS 16,116.42 16,114.94 16.26,114.68 18.03,114.68 | D3.A 20.73,118.65 20.19,118.11 20.19,115.06 19.81,114.68 18.03,114.68 | IC1.5 17.65,112.9 18.03,113.28 18.03,114.68
N$28
  Top 0.61: R26.1 4.61,69.68 4.95,69.34 4.95,68.3 T2.1
N$29
  Top 0.406: T3.C 15.79,105.96 16.04,106.21 R30.2
  Top 0.813: T3.C 15.71,104.95 SW3.2
N$30
  Top 0.813: CON12.1-2 40.55,114.94 CON12.1-1 40.55,117.56 39.47,118.65 D2.A
N$31  (via drill 0.25 pad 0.25)
  Top 0.61: SW3.3 20.56,102.09 v20.95,102.49 | v22.86,103.12 22.96,103.23 IC2.3
  Bottom 0.61: v20.95,102.49 22.22,102.49 v22.86,103.12
N$32  (via drill 0.25 pad 0.25)
  Top 0.152: R29.2 19.72,104.01
  Top 0.406: 19.72,104.01 v20.83,104.01
  Top 0.61: T3.B 19.66,104.08 R29.2
  Bottom 0.406: JP3.2 v20.83,104.01
PIO0_14
  Top 0.152: IC3.24 13.24,89.44 12.95,89.15 12.95,86.61 TP11.TP
PWM0  (via drill 0.25 pad 0.25)  (1 unrouted)
  Top 0.152: v102.74,97.03 102.74,98.77 R11.1
  Bottom 0.152: v102.74,97.03 103.89,95.89 103.89,88.27 101.6,85.98 101.6,75.69 98.55,72.77 98.55,65.28 103.5,60.33 103.5,22.73 96.01,15.24 SKT1.21
PWM1  (via drill 0.25 pad 0.25)
  Top 0.152: v102.74,102.23 102.7,102.27 R12.1
  Bottom 0.152: v102.74,102.23 102.74,101.73 101.85,100.84 101.85,96.65 103.38,95.12 103.38,88.65 101.09,86.36 101.09,76.07 97.92,72.9 97.92,64.9 102.74,60.07 102.74,22.99 97.54,17.78 SKT1.P$62 SKT1.22
PWM2  (via drill 0.25 pad 0.25)
  Top 0.152: v102.74,106.93 102.74,108.93 R13.1 | SKT1.P$63 SKT1.23
  Bottom 0.152: v102.74,106.93 101.47,105.66 101.47,96.27 102.87,94.87 102.87,88.77 100.58,86.49 100.58,76.33 97.54,73.28 97.54,64.26 101.98,59.82 101.98,23.24 99.06,20.32 SKT1.23
RX1  (via drill 0.25 pad 0.25)
  Top 0.152: CON2.1 59.48,112.57 v55.5,108.59 | SKT1.10 17.78,40.64 | 17.78,40.64 25.53,48.39 25.53,75.82 v55.5,105.79 | R23.2 35.01,40.64 17.78,40.64
  Bottom 0.152: v55.5,105.79 v55.5,108.59 | SKT1.P$50 SKT1.10
RX2  (via drill 0.25 pad 0.25)
  Top 0.152: SKT1.31 v77.85,40.64 74.46,40.64 R18.2
  Bottom 0.152: CON6.1 66.98,97.92 84.07,97.92 84.96,97.03 84.96,68.58 84.2,66.8 84.2,46.99 v77.85,40.64 | SKT1.31 SKT1.P$71
SCK1  (via drill 0.25 pad 0.25)
  Top 0.152: LCD1.P$14 62.36,35.31 54.99,27.94 v43.43,27.94 v23.75,27.94 SKT1.15 | v66.29,16.51 67.31,15.49 v67.31,9.65
  Bottom 0.152: v23.75,27.94 31.88,36.07 31.88,104.65 35.18,107.95 38.73,107.95 44.07,113.28 86.49,113.28 87.42,114.22 CON1.1 | v43.43,27.94 54.86,16.51 v66.29,16.51 | SKT1.P$55 SKT1.15 | v67.31,9.65 67.31,8.2 CON10.5
SCK2
  Bottom 0.152: CON7.1 87.42,105.36 91.19,101.6 91.19,69.72 87.25,65.79 87.25,31.62 90.93,27.94 SKT1.26 SKT1.P$66
SCL  (via drill 0.25 pad 0.25)
  Top 0.152: R15.1 77.72,88.39 | 77.72,88.39 77.72,77.98 78.61,77.09 IC5.6 | v81.03,88.39 82.11,89.48 IC4.2 84.64,89.48 85.34,88.77 85.34,85.72 JP4.4 | v78.61,88.39 77.72,88.39
  Bottom 0.152: v81.03,88.39 v78.61,88.39
SCL1  (via drill 0.25 pad 0.25)
  Top 0.152: CON5.1 73.45,108.76 69.6,104.9 69.6,84.33 | SKT1.12 53.72,35.56 v57.78,39.62 | v69.22,56.52 69.6,56.9 69.6,84.33 | v68.45,84.33 69.6,84.33
  Bottom 0.152: v57.78,39.62 69.22,51.05 v69.22,56.52 | JP4.2 v68.45,84.33 | SKT1.P$52 SKT1.12
SCL2  (via drill 0.25 pad 0.25)
  Top 0.152: v84.07,35.56 SKT1.29 | JP4.6 v89.66,84.33
  Bottom 0.152: CON8.1 73.45,104.47 78.36,99.57 88.65,99.57 89.66,98.55 v89.66,84.33 89.66,70.23 85.72,66.29 85.72,39.75 84.07,38.1 v84.07,35.56 | SKT1.29 SKT1.P$69
SDA
  Top 0.152: R14.1 79.5,90.17 | 79.5,90.17 79.5,79.12 80.26,78.36 IC5.5 83.44,78.36 83.95,78.87 JP4.3 | IC4.1 79.54,90.13 79.5,90.17
SDA1  (via drill 0.25 pad 0.25)
  Top 0.152: CON5.2 75.45,109.74 70.36,104.65 70.36,81.79 | SKT1.11 v52.58,38.1 | 70.36,81.79 v70.36,55.37 | v71.5,81.79 70.36,81.79
  Bottom 0.152: v52.58,38.1 64.9,38.1 70.36,43.56 v70.36,55.37 | JP4.1 v71.5,81.79 | SKT1.P$51 SKT1.11
SDA2  (via drill 0.25 pad 0.25)
  Top 0.152: v85.72,38.1 SKT1.30 | JP4.5 v90.42,81.79
  Bottom 0.152: CON8.2 75.45,103.23 78.36,100.33 88.9,100.33 90.42,98.81 v90.42,81.79 90.42,69.98 86.49,66.04 86.36,38.73 v85.72,38.1 | SKT1.30 SKT1.P$70
TGT_CTS  (via drill 0.25 pad 0.25)
  Top 0.152: IC3.30 17.51,87.64 18.54,86.61 v18.54,83.82 | v81.91,60.96 SKT1.39 | v26.42,74.68 26.42,67.82 32,62.23 v58.55,62.23
  Bottom 0.152: v18.54,83.82 21.34,81.03 21.34,79.76 v26.42,74.68 | SKT1.39 SKT1.P$79 | v81.91,60.96 59.82,60.96 v58.55,62.23
TGT_NRESET  (via drill 0.25 pad 0.25)
  Top 0.152: 9.02,75.31 9.02,78.11 9.78,78.87 9.78,79.73 D1.A | IC3.8 19.31,93.74 v19.81,94.23 | v10.79,75.31 9.02,75.31 | 9.02,75.31 9.02,52.07 10.29,50.8 SKT1.P$46 | CON11.10 37.59,49.02 36.83,48.26 v26.92,48.26
  Bottom 0.152: v19.81,94.23 17.78,92.2 17.78,83.19 20.57,80.39 20.57,77.98 18.67,76.07 11.56,76.07 v10.79,75.31 | SKT1.P$46 SKT1.6 19.05,50.8 21.59,48.26 v26.92,48.26
TGT_NRESET_BUTTON  (via drill 0.25 pad 0.25)
  Top 0.152: SW1.A1 SW1.A2 7.24,79.72 | 7.24,79.72 D1.K | R6.2 26.42,86.36 26.8,85.98 26.8,80.9 25.78,79.88 24.13,79.88 | 24.13,79.88 v19.68,79.88 | R7.2 24.22,79.97 24.13,79.88 | 7.24,79.72 7.24,80.52 7.75,81.03 11.68,81.03 12.57,81.92 14.1,81.92 v16.13,79.88
  Bottom 0.152: v16.13,79.88 v19.68,79.88
TGT_NRESET_FB
  Top 0.152: IC3.3 20.94,90.44 21.34,90.04 21.34,86.74 21.72,86.36 R6.1
TGT_NRESET_FB_ISP
  Top 0.152: IC3.1 20.16,89.44 20.32,89.28 20.32,82.17 20.7,81.79 R7.1
TGT_RTS  (via drill 0.25 pad 0.25)
  Top 0.152: IC3.16 14.09,93.74 v13.72,94.11 | SKT1.38 91.57,59.82 v80.77,59.82 | v17.27,77.22 22.35,72.14 22.35,64.13 v22.61,63.88 | v41.27,60.58 29.59,60.58 v26.29,63.88
  Bottom 0.152: SKT1.38 SKT1.P$78 | v13.72,94.11 13.72,92.08 13.21,91.57 13.21,81.92 14.35,80.77 14.35,80.14 v17.27,77.22 | v41.27,60.58 58.42,60.58 59.18,59.82 v80.77,59.82 | v26.29,63.88 v22.61,63.88 20.7,63.88 16.76,67.82 JP2.2
TGT_RX  (via drill 0.25 pad 0.25)
  Top 0.152: 24.26,50.55 24.26,72.39 18.51,78.13 18.51,80.49 19.68,81.66 19.68,86.74 18.51,87.91 IC3.32 | 24.26,50.55 24.26,49.66 20.32,45.72 SKT1.8 | CON11.8 35.94,51.18 35.31,50.55 v27.43,50.55 | v23.11,49.78 23.88,50.55 24.26,50.55
  Bottom 0.152: SKT1.P$48 SKT1.8 | v27.43,50.55 23.88,50.55 v23.11,49.78
TGT_SWCLK  (via drill 0.25 pad 0.25)  (1 unrouted)
  Top 0.152: SKT1.5 19.18,53.34 20.51,54.67 | v13.21,80.65 13.21,79.88 20.83,72.26 v20.83,70.1 20.83,54.99 20.51,54.67 | IC3.18 13.06,92.44 12.57,91.95 11.81,91.95 11.43,92.33 11.43,93.22 v12.32,94.11 | CON11.4 35.94,53.72 35.31,53.09 28.96,53.09 v27.94,54.1 | v21.08,54.1 20.51,54.67
  Bottom 0.152: v13.21,80.65 12.7,81.15 12.7,91.82 13.14,92.27 13.14,93.28 v12.32,94.11 | SKT1.P$45 SKT1.5 | v27.94,54.1 v21.08,54.1 | JP2.1 11.18,69.47 11.81,70.1 20.7,70.1 20.83,70.23
TGT_SWDIO  (via drill 0.25 pad 0.25)
  Top 0.152: v12.32,92.58 12.67,92.94 IC3.17 | v12.32,79.12 20.07,71.37 20.07,57.15 v18.8,55.88 SKT1.4 | CON11.2 37.59,56.13 37.08,56.64 27.94,56.64 v27.18,55.88
  Bottom 0.152: v12.32,92.58 v12.32,79.12 | SKT1.P$44 SKT1.4 | v27.18,55.88 v18.8,55.88
TGT_TX  (via drill 0.25 pad 0.25)
  Top 0.152: 23.62,52.32 23.62,72.26 18.01,77.87 18.01,80.62 19.18,81.79 19.18,86.61 18.01,87.78 IC3.31 | 23.62,52.32 23.62,51.56 20.32,48.26 SKT1.7 | CON11.7 28.57,51.18 v27.43,52.32 | v22.35,52.32 23.62,52.32
  Bottom 0.152: SKT1.P$47 SKT1.7 | v27.43,52.32 v22.35,52.32
TX1  (via drill 0.25 pad 0.25)
  Top 0.152: CON2.2 61.48,113.17 24.89,76.58 24.89,49.02 19.05,43.18 SKT1.9 | R23.1 21.76,42.38 v21.72,42.42
  Bottom 0.152: v21.72,42.42 17.53,42.42 SKT1.9 SKT1.P$49
TX2  (via drill 0.25 pad 0.25)
  Top 0.152: SKT1.32 v81.91,43.18 81.11,42.38 R18.1
  Bottom 0.152: CON6.2 68.22,98.68 84.33,98.68 85.47,97.54 85.47,68.2 84.96,66.55 84.96,46.23 v81.91,43.18 | SKT1.32 SKT1.P$72
USB-D+
  Top 0.152: R10.1 15.24,113.54 15.55,113.85 IC1.6
USB-D-
  Top 0.152: R9.1 16.89,111 16.41,111.48 IC1.4
USB-SCON  (1 unrouted)
  Top 0.152: T1.1 7.81,97.34 8,97.16 14.99,97.16 15.49,96.65 15.49,93.76
USB_DM
  Top 0.152: C8.1 R9.2 16.89,97.41 16.51,97.03 IC3.13
USB_DP
  Top 0.152: R8.2 C9.1 R10.2 15.24,106.81 14.6,106.17 14.6,98.42 16.01,97.02 IC3.14
V_ISENSE  (via drill 0.25 pad 0.25)
  Top 0.152: CON11.1 26.67,54.99 26.29,55.37 v26.29,60.96
  Top 0.406: TP8.TP R25.1
  Top 0.61: SKT1.P$42 SKT1.2
  Top 0.813: R25.1 14.18,61 SKT1.P$42
  Bottom 0.152: v26.29,60.96 SKT1.2
VCC_GROVE
  Top 0.813: 63.5,105.41 CON6.3 CON2.3 63.48,118.36 | 63.48,118.36 49.51,118.36 CON3.3 49.51,106.93 | 63.48,118.36 77.47,118.36 77.47,115.57 CON5.3 CON8.3 | 49.51,106.93 CON4.3 | JP1.2 38.73,103.76 42.04,107.06 49.39,107.06 49.51,106.93

### Text on the board
tPlace: 3v3 | SPI1 | ANALOG | UART1 | I2C1 | GND | AIN1 | AIN2 | VCC | GND | RX | TX | VCC | GND | SCL | SDA | VCC | GND | SCK | MISO | MOSI | SEL | PWM2 | UART2 | I2C2 | SPI2 | PWM1 | DIGITAL | !PWR_EN | GP2 | GP3 | VCC | GND | RX | TX | VCC | GND | SCL | SDA | VCC | GND | SCK | SEL | MISO | MOSI | PWM0 | 3v3 | Vbus | PWR | Grove Vcc | AIN0 | DAP | LM75B | COM | SDA | SCL | 1 | 2 | RESET | GP0 | DAPlink | GND | GND | 3V3 | TGT_CTS | Vbus | TGT_RTS | SWDIO | GP8 | SWCLK | GP7 | nRESET | GP6 | TGT_TX | GP5 | TGT_RX | GP4 | TX1 | TX2 | RX1 | TX1/RX1 / Loopback | TX2/RX2 / Loopback | RX2 | SDA1 | SDA2 | SCL1 | SCL2 | MOSI1 | MOSI2 | MISO1 | MISO2 | SCK1 | SCK2 | GP0 | GP3 | GP2/3 / Loopback | GP1 | GP2 | AIN0 | AIN0-CI | PWM2 | AIN1 | AIN1-CI | PWM1 | AIN2 | AIN2-CI | PWM0 | Module Test Bed v1.2.0
bPlace: : MOSI1 | MOSI | LCD | : SCK1 | SCK | C128032A1Z | : GP5 | A0 | : GP6 | RESET | : GP7 | nCS | : GP0 | Button | : PWM2 | Red LED | : PWM1 | Green LED | : PWM0 | Blue LED | : AIN0 | Potentiometer | : SCL1/2 | SCL | Temperature | : SDA1/2 | SDA | LM75B | : 0x90 | Addr | : SCL1/2 | SCL | EEPROM | : SDA1/2 | SDA | AT24LC256 | : 0xA0 | Addr | : MOSI1 | MOSI | SD Card | : MISO1 | MISO | : SCK1 | SCK | : GP2 | nCS
TopSilkscreen: SWDIO | SWCLK | nRESET
225bmp: PWR | HID | COM | RESET